# EasyEDA Pro project Explorer.eprj

# Schematic 驱动板

## Sheets
1 STM32C6T6: Create Date: 2024-03-30; Page Name: STM32C6T6; Project Name: 遥控小车+机械臂; Schematic Name: 原理图; Update Date: 2024-03-30; Company: 嘉立创EDA; Drawed: Ideal_Fox; Page Size: A4; Version: V1.0
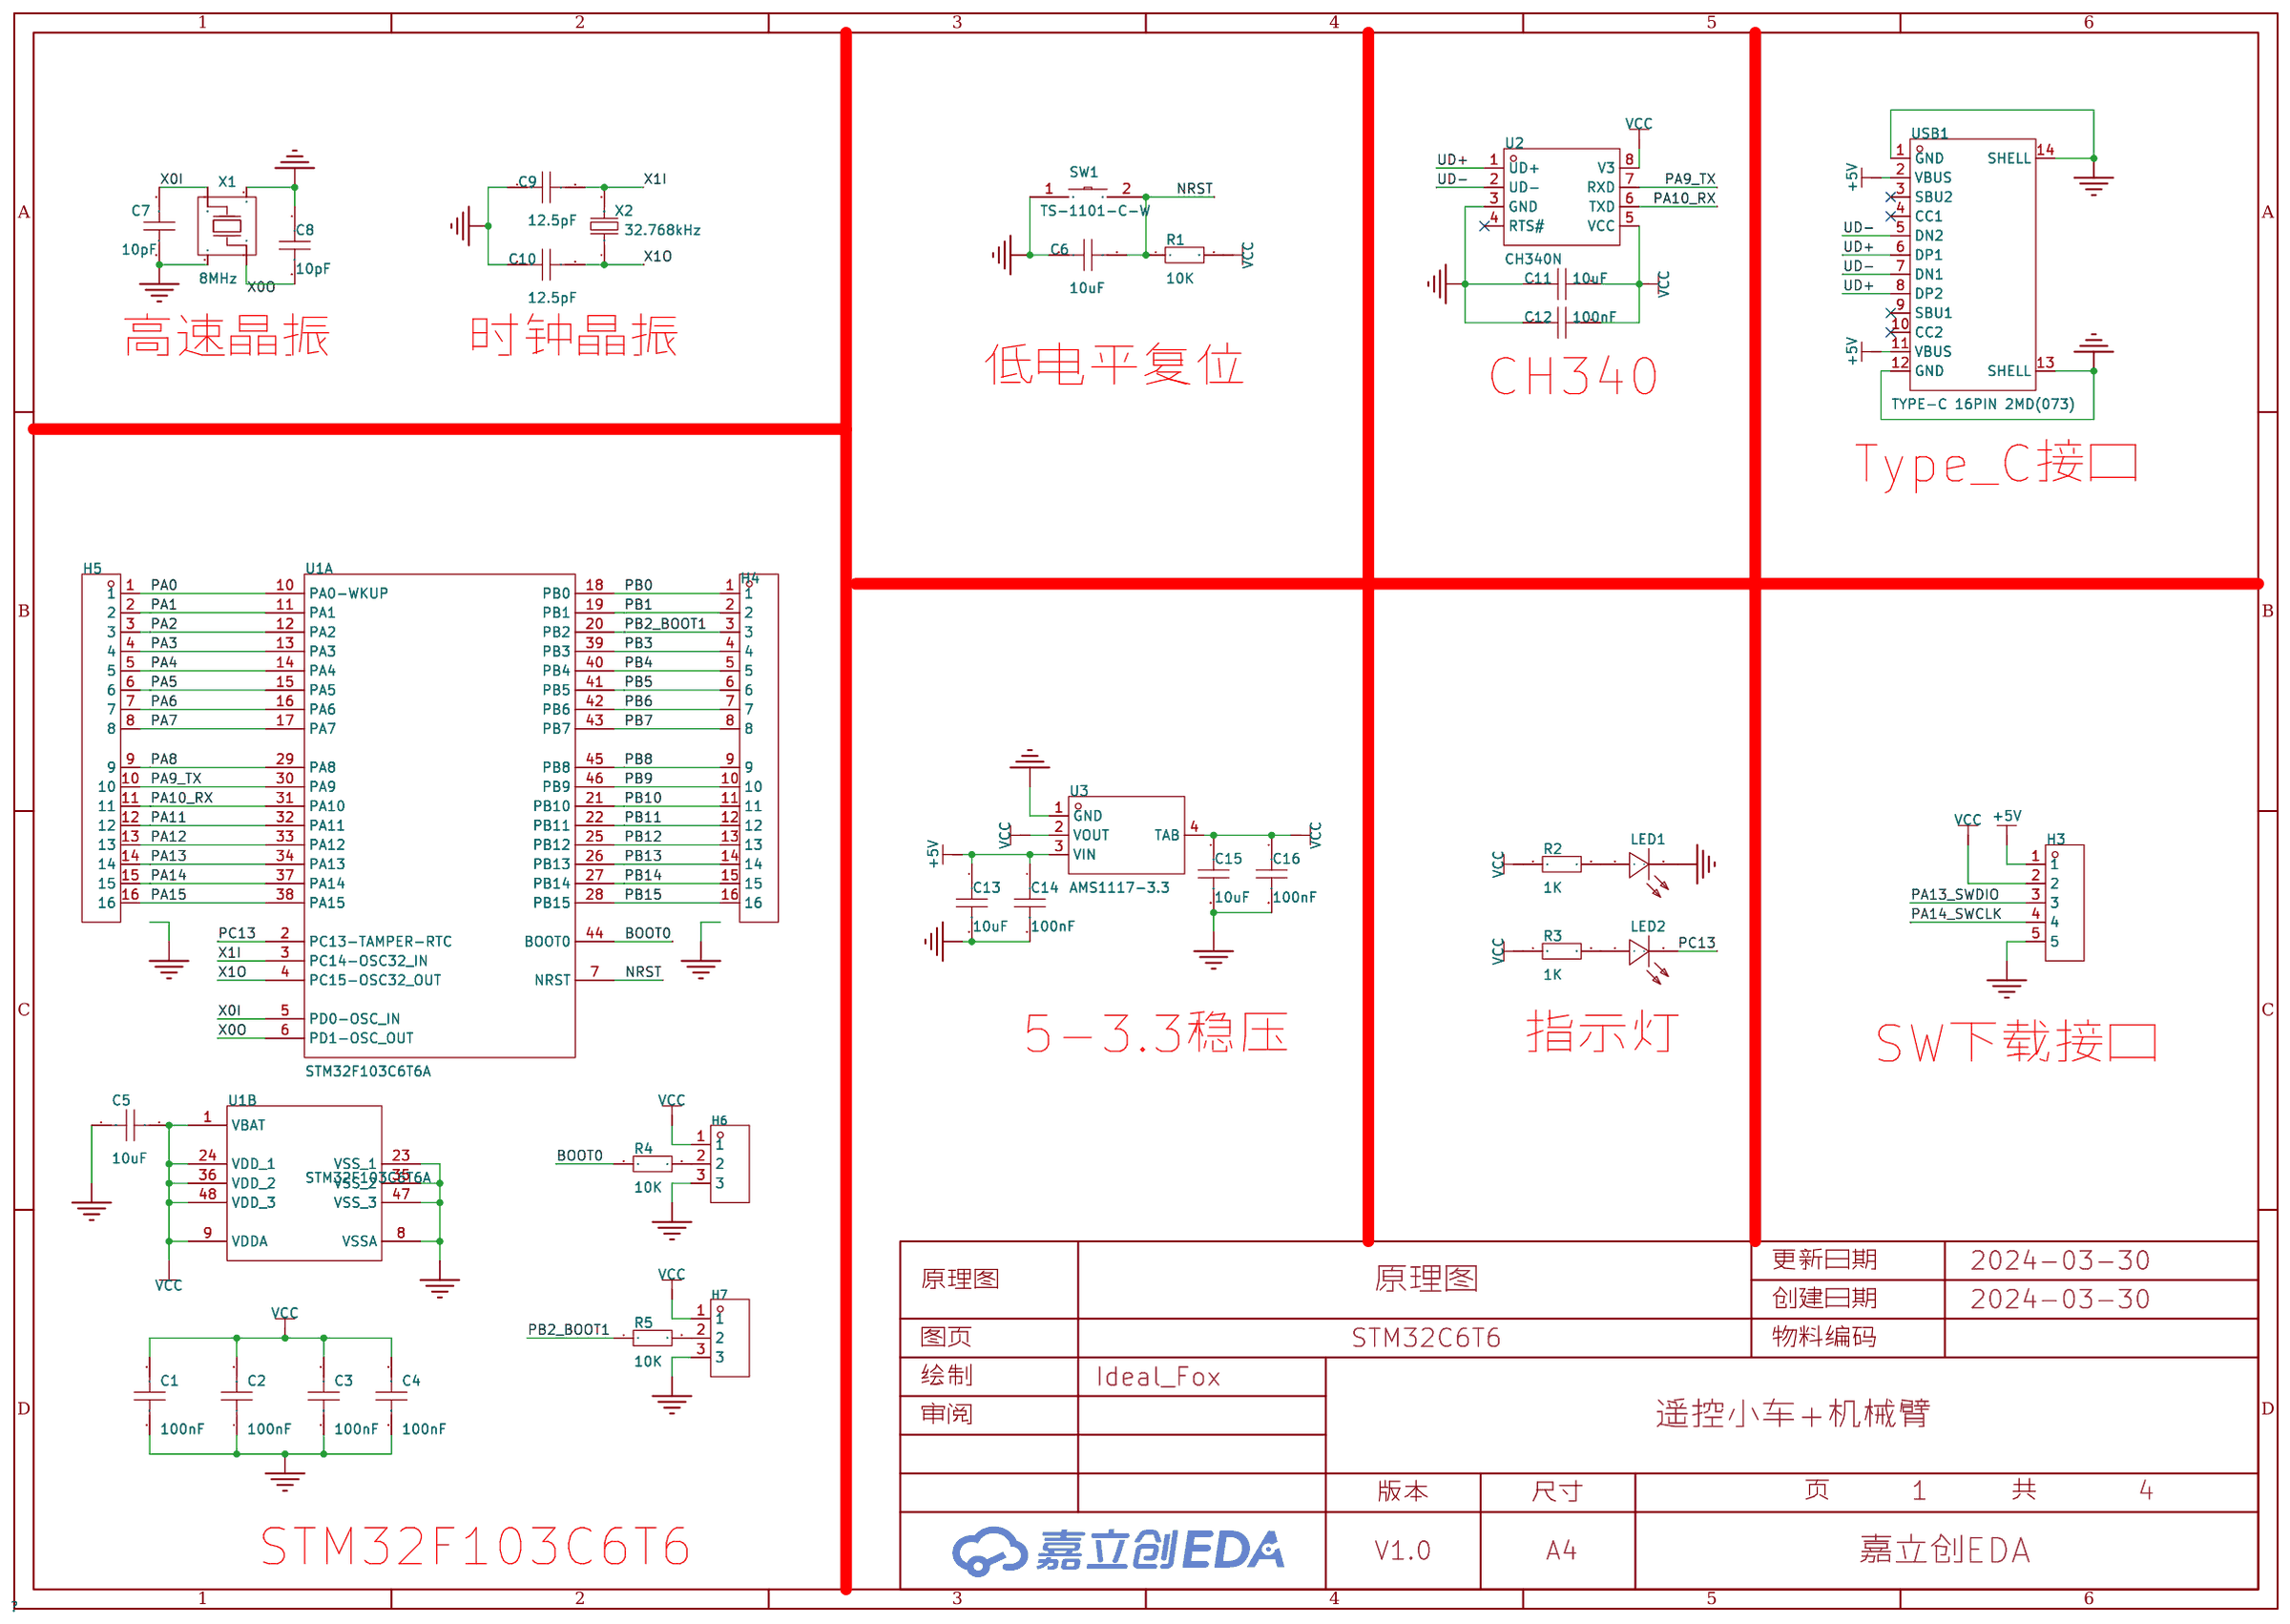
[diagram p0: STM32C6T6]
2 机械臂控制电路: Page Name: 机械臂控制电路; Schematic Name: 接收控制; Update Date: 2024-04-04
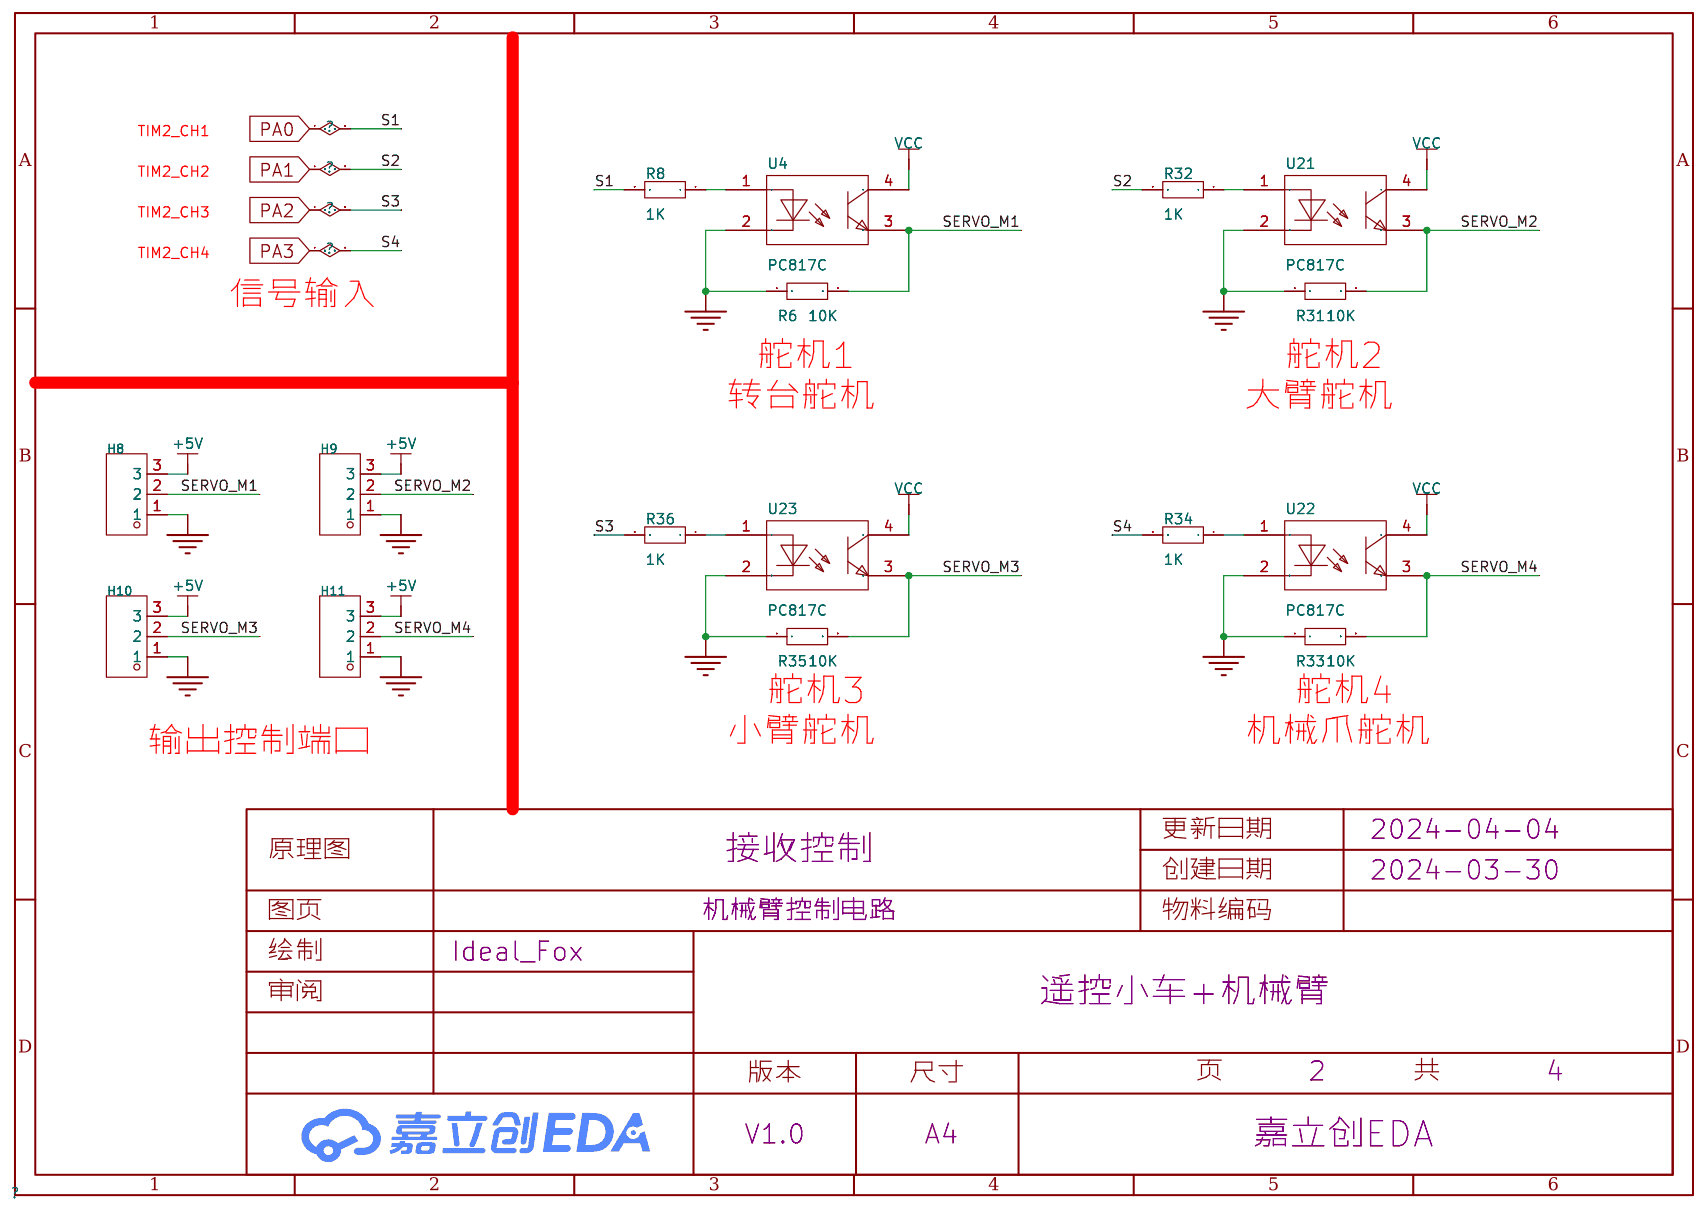
[diagram p1: 机械臂控制电路]
3 小车控制电路: Create Date: 2024-04-02; Page Name: 小车控制电路; Project Name: Explorer; Schematic Name: 驱动板; Update Date: 2024-10-26
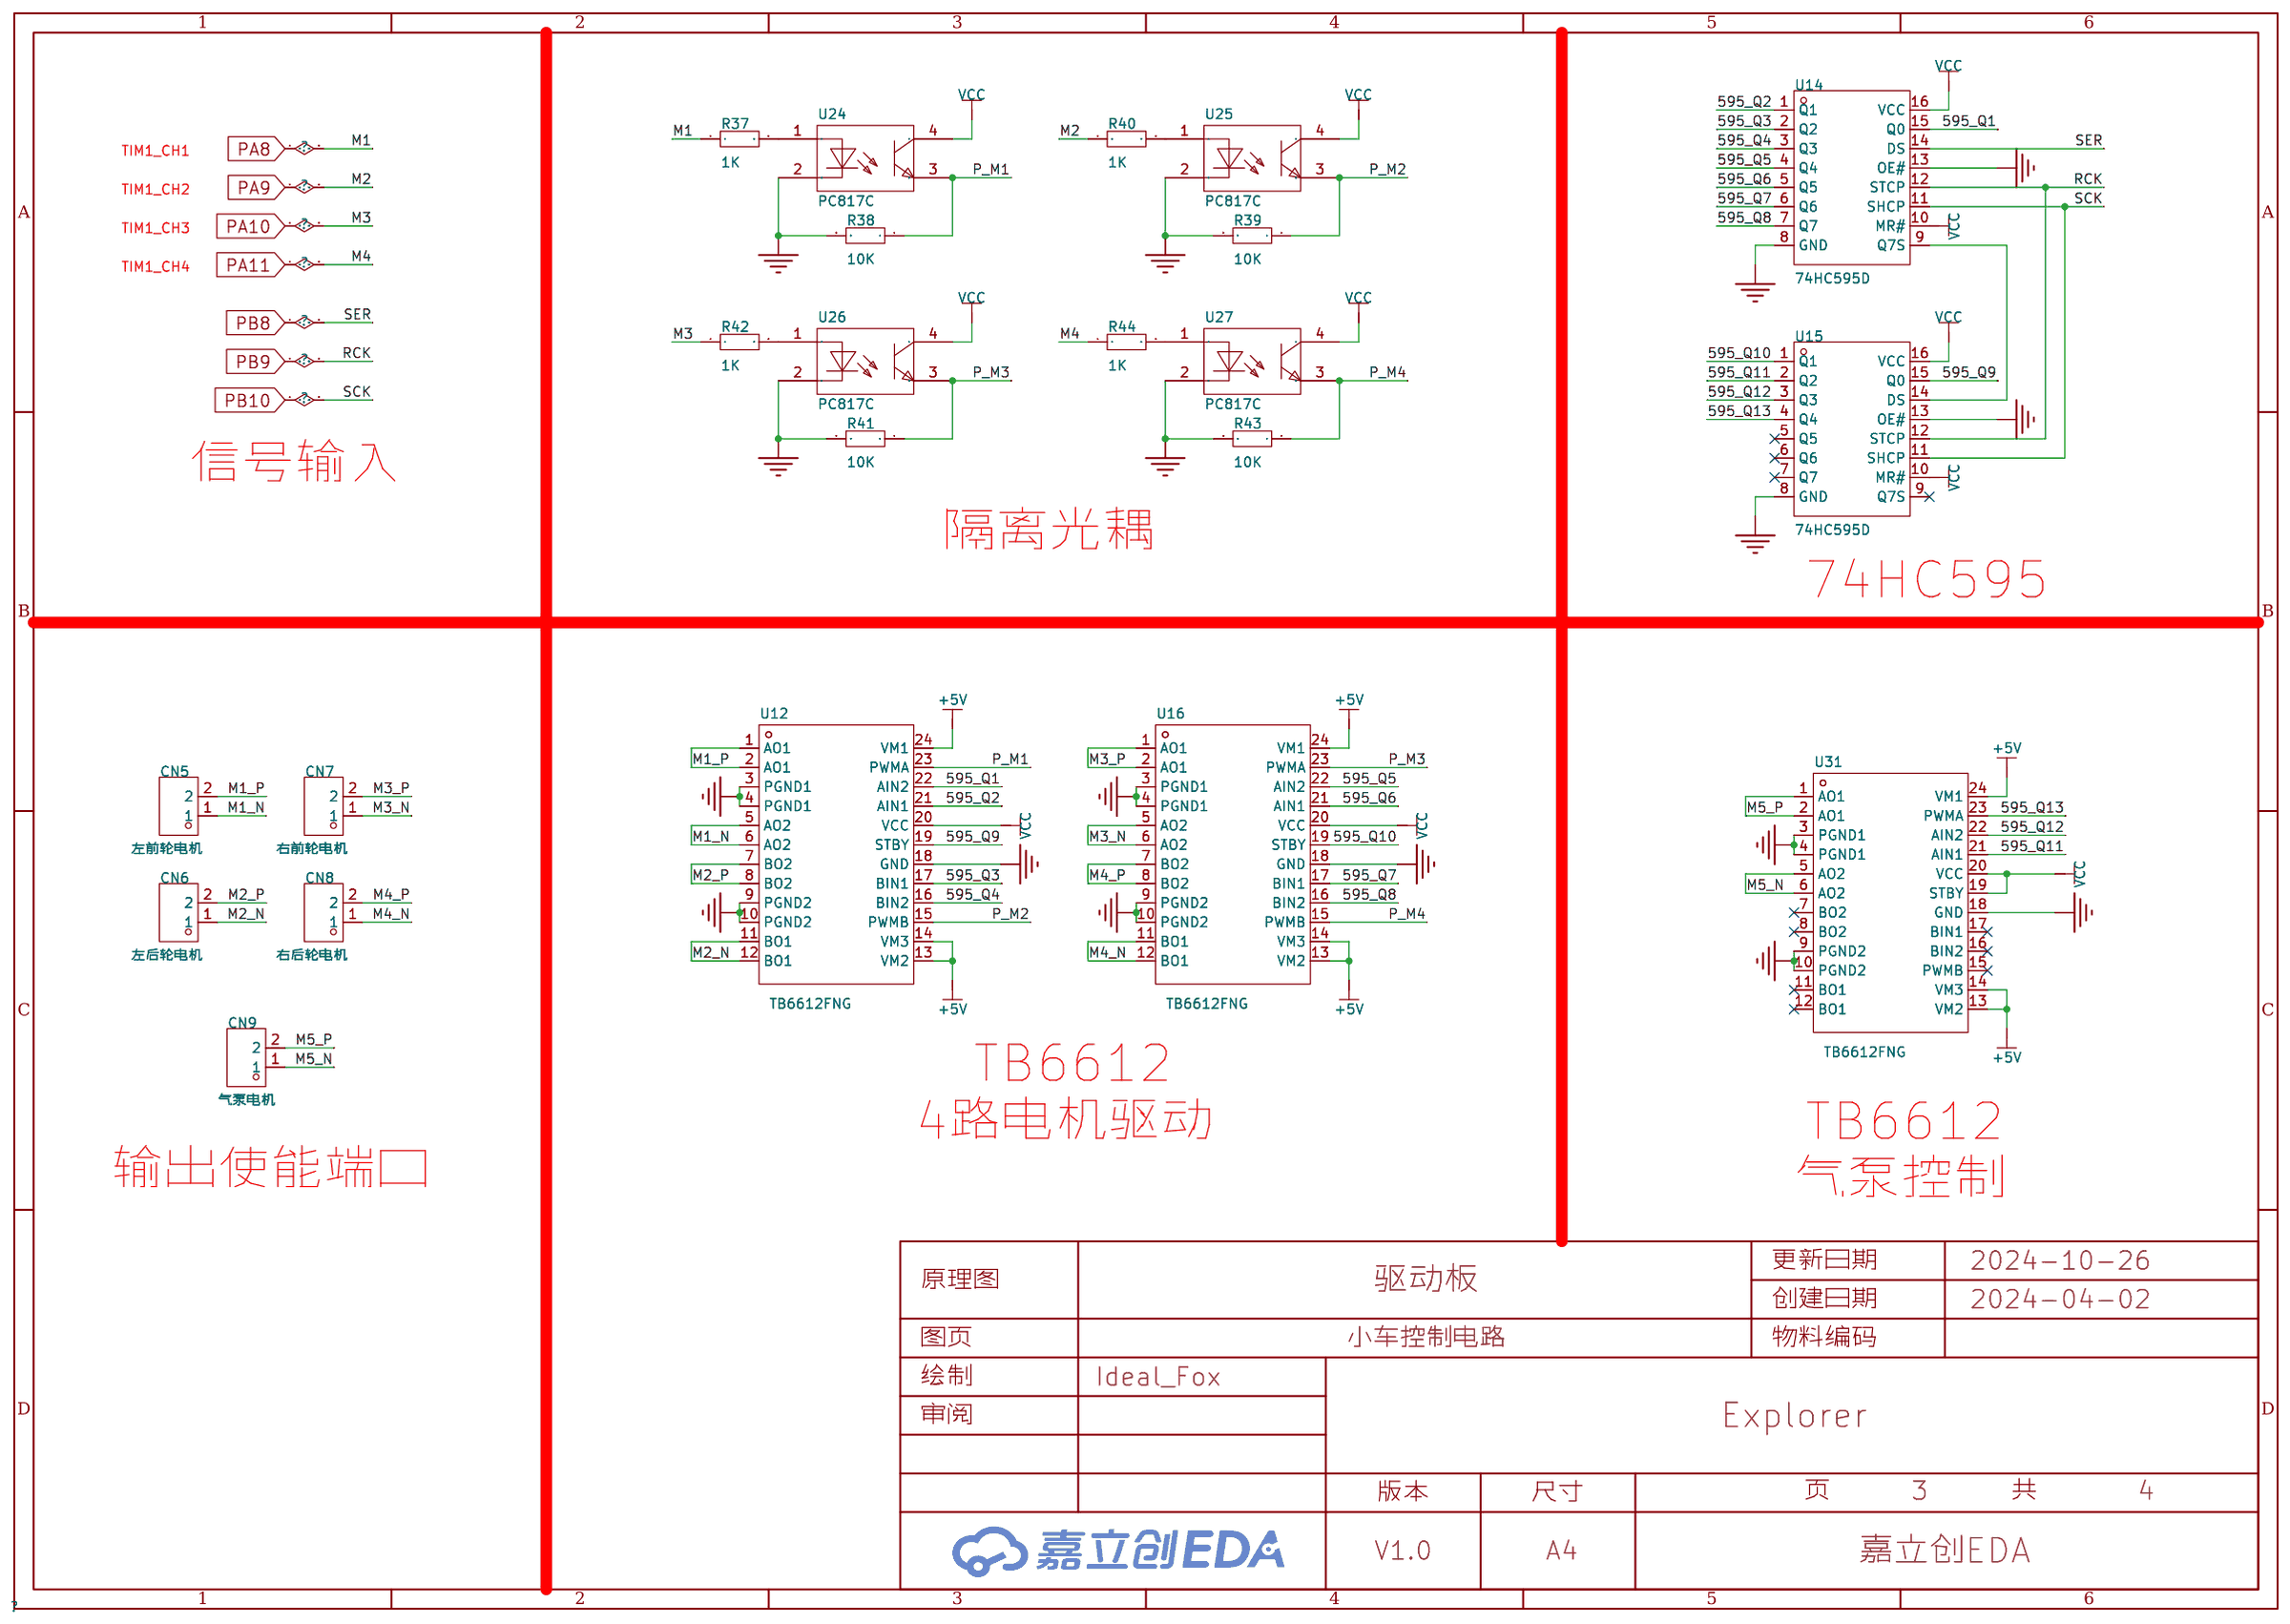
[diagram p2: 小车控制电路]
4 Other: Create Date: 2024-04-06; Page Name: Other; Project Name: Explorer; Schematic Name: 驱动板; Update Date: 2024-05-18; Page Size: A5
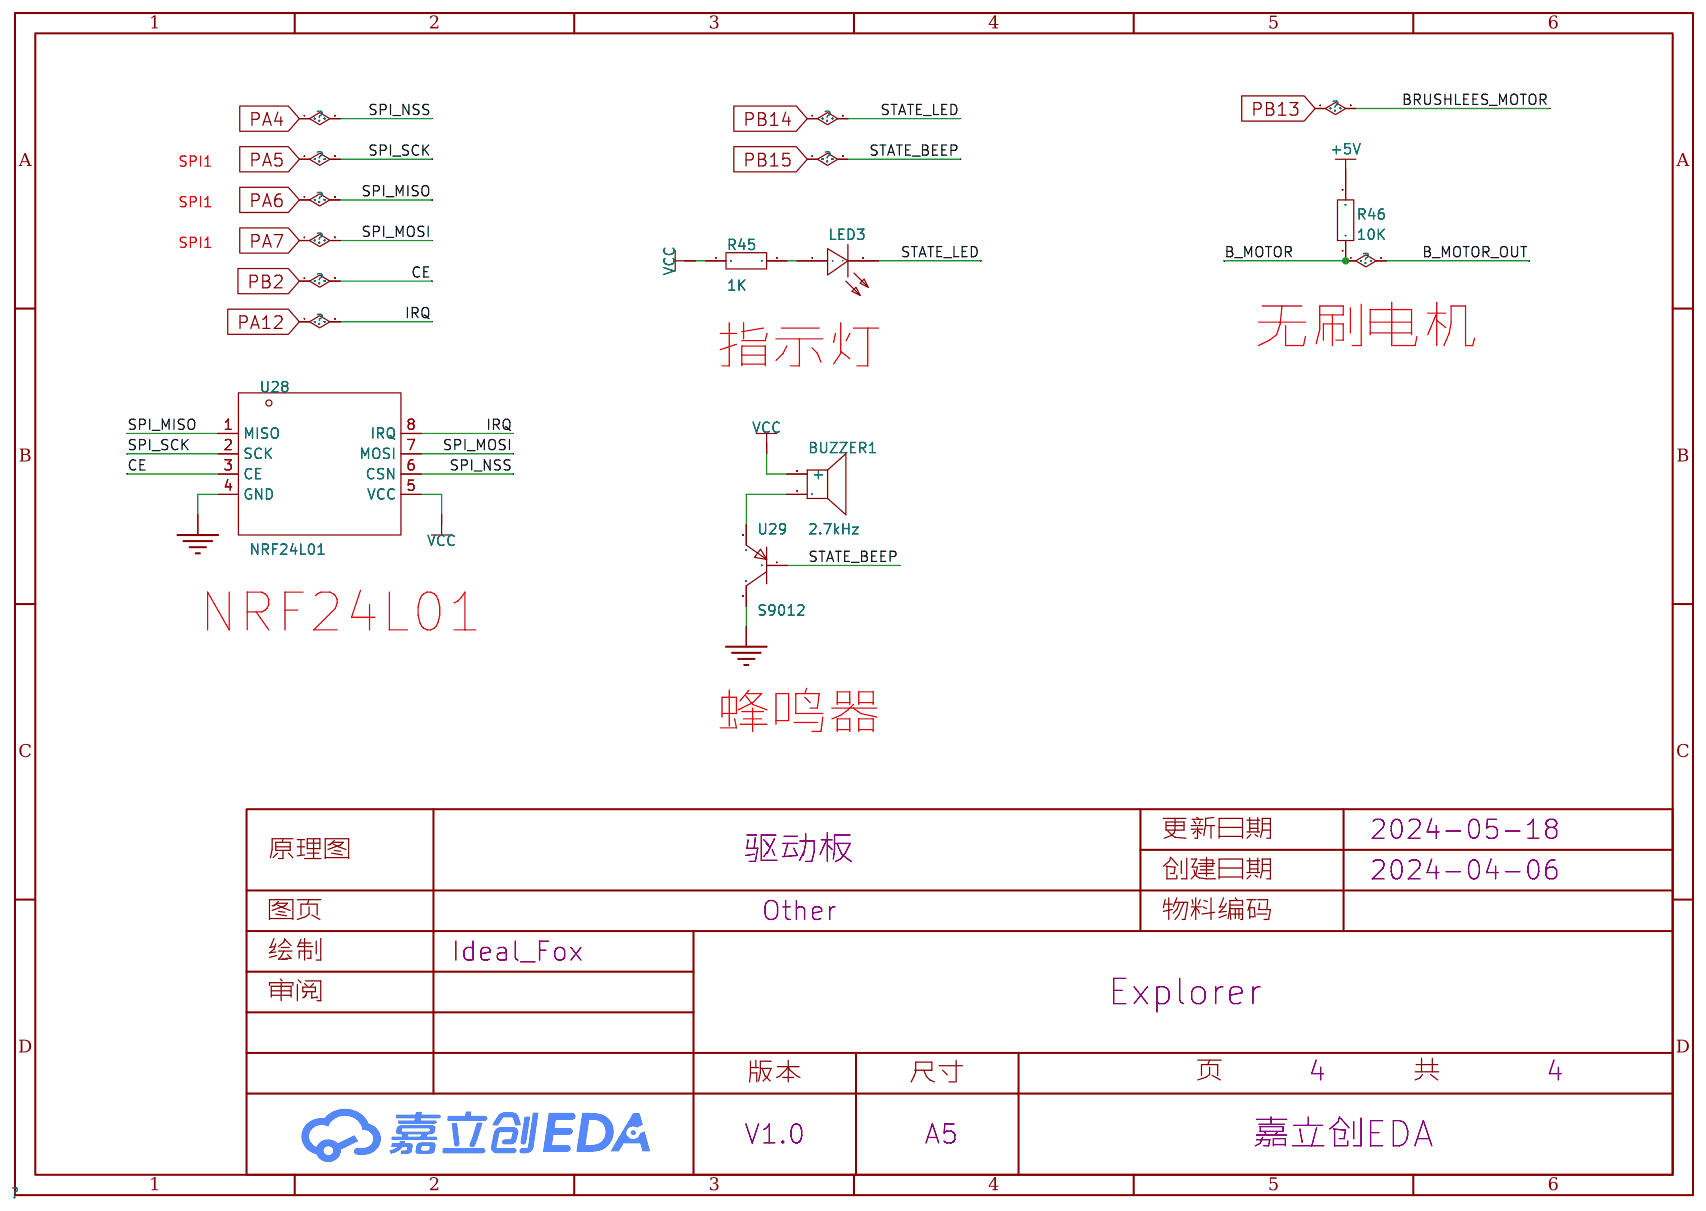
[diagram p3: Other]

## Parts
sheet Other
BUZZER1  2.7kHz  [BUZ-TH_BD12.0-P7.60-D0.6-FD]
LED3  NCD0805R1  [LED0805-R-RD]
R45  1K  [R0603]
R46  10K  [R0603]
U28  NRF24L01  [QFN-20_L4.0-W4.0-P0.50-BL-EP2.7]
U29  S9012  [SOT-23-3_L2.9-W1.4-P1.90-LS2.6-BR]
sheet STM32C6T6
C1  100nF  [C0603]
C2  100nF  [C0603]
C3  100nF  [C0603]
C4  100nF  [C0603]
C5  10uF  [C0603]
C6  10uF  [C0603]
C7  10pF  [C0603]
C8  10pF  [C0603]
C9  12.5pF  [C0603]
C10  12.5pF  [C0603]
C11  10uF  [C0603]
C12  100nF  [C0603]
C13  10uF  [C0603]
C14  100nF  [C0603]
C15  10uF  [C0603]
C16  100nF  [C0603]
H3  PZ254-1-05-W-8.5  [HDR-TH_5P-P2.54-H-M-W10.4-N]
H4  X6511WV-20H-C60D30  [HDR-TH_20P-P2.54-V-M]
H5  X6511WV-20H-C60D30  [HDR-TH_20P-P2.54-V-M]
H6  PZ254V-11-03P  [HDR-TH_3P-P2.54-V-M]
H7  PZ254V-11-03P  [HDR-TH_3P-P2.54-V-M]
LED1  NCD0805R1  [LED0805-R-RD]
LED2  NCD0805R1  [LED0805-R-RD]
R1  10K  [R0603]
R2  1K  [R0603]
R3  1K  [R0603]
R4  10K  [R0603]
R5  10K  [R0603]
SW1  TS-1101-C-W  [SW-SMD_L6.0-W3.3-LS8.0]
U1  STM32F103C6T6A  [LQFP-48_L7.0-W7.0-P0.50-LS9.0-BL]  (sections 1,2)
U2  CH340N  [SOP-8_L4.9-W3.9-P1.27-LS6.0-BL]
U3  AMS1117-3.3  [SOT-223-3_L6.5-W3.5-P3.05-LS7.0]
USB1  TYPE-C 16PIN 2MD(073)  [USB-C-SMD_TYPE-C-6PIN-2MD-073]
X1  8MHz  [OSC-SMD_4P-L3.2-W2.5-BL]
X2  32.768kHz  [FC-135R_L3.2-W1.5]
sheet 小车控制电路
CN5  左前轮电机  [CONN-TH_KF2510-2A]
CN6  左后轮电机  [CONN-TH_KF2510-2A]
CN7  右前轮电机  [CONN-TH_KF2510-2A]
CN8  右后轮电机  [CONN-TH_KF2510-2A]
CN9  气泵电机  [CONN-TH_KF2510-2A]
R37  1K  [R0603]
R38  10K  [R0603]
R39  10K  [R0603]
R40  1K  [R0603]
R41  10K  [R0603]
R42  1K  [R0603]
R43  10K  [R0603]
R44  1K  [R0603]
U12  TB6612FNG  [SSOP-24_L8.3-W5.6-P0.65-LS7.6-BL]
U14  74HC595D  [SOIC-16_L9.9-W3.9-P1.27-LS6.0-BL]
U15  74HC595D  [SOIC-16_L9.9-W3.9-P1.27-LS6.0-BL]
U16  TB6612FNG  [SSOP-24_L8.3-W5.6-P0.65-LS7.6-BL]
U24  PC817C  [OPTO-SMD-4_L4.6-W6.5-P2.54-LS10.3-TL]
U25  PC817C  [OPTO-SMD-4_L4.6-W6.5-P2.54-LS10.3-TL]
U26  PC817C  [OPTO-SMD-4_L4.6-W6.5-P2.54-LS10.3-TL]
U27  PC817C  [OPTO-SMD-4_L4.6-W6.5-P2.54-LS10.3-TL]
U31  TB6612FNG  [SSOP-24_L8.3-W5.6-P0.65-LS7.6-BL]
sheet 机械臂控制电路
H8  PZ254V-11-03P  [HDR-TH_3P-P2.54-V-M]
H9  PZ254V-11-03P  [HDR-TH_3P-P2.54-V-M]
H10  PZ254V-11-03P  [HDR-TH_3P-P2.54-V-M]
H11  PZ254V-11-03P  [HDR-TH_3P-P2.54-V-M]
R6  10K  [R0603]
R8  1K  [R0603]
R31  10K  [R0603]
R32  1K  [R0603]
R33  10K  [R0603]
R34  1K  [R0603]
R35  10K  [R0603]
R36  1K  [R0603]
U4  PC817C  [OPTO-SMD-4_L4.6-W6.5-P2.54-LS10.3-TL]
U21  PC817C  [OPTO-SMD-4_L4.6-W6.5-P2.54-LS10.3-TL]
U22  PC817C  [OPTO-SMD-4_L4.6-W6.5-P2.54-LS10.3-TL]
U23  PC817C  [OPTO-SMD-4_L4.6-W6.5-P2.54-LS10.3-TL]

## Library data of the parts
BUZZER1 = TMB12A05_C96093: 驱动方式:有源(内含驱动线路);构造类型:电磁式;频率:2.7kHz;声压(SPL):85dB;; LCSC Part Name: TMB12A05; Supplier Part: C96093; Manufacturer: 华能; Manufacturer Part: TMB12A05; Supplier Footprint: 插件,D=12mm; JLCPCB Part Class: 扩展库; Datasheet: https://atta.szlcsc.com/upload/public/pdf/source/20230426/A4FC10532558AA232D532AB83455FBA4.pdf; Supplier: LCSC; Oscillator Circuit: 有源(内含驱动线路); Technology Type: 电磁式; Operating Voltage: 4V~8V; Sound Pressure Level (SPL): 85dB; Diameter (φD): 12mm; Height: 9.8mm
LED1-LED3 = NCD0805R1: 灯头类型:-;发光颜色:红色;正向电压(VF):1.6V~2.6V;功率:65mW;正向电流:20mA;主波长:615nm~630nm;二极管配置:独立二极管;透镜颜色:无色透明透镜;色温:-;发光强度:67mcd~195mcd;发光角度:130°;载带方式:-;工作温度:-30℃~+85℃;; Supplier Part: C84256; Manufacturer: 国星光电; Supplier Footprint: 0805; JLCPCB Part Class: 基础库; Datasheet: https://atta.szlcsc.com/upload/public/pdf/source/20200820/C84256_F0A75A43B3EAD75808600A0514C76B99.pdf; Supplier: LCSC; Emitted Color: 红色; Forward Voltage (VF): 1.6V~2.6V; Power Dissipation: 65mW; Forward Current: 20mA; Dominant Wavelength: 615nm~630nm; Diode Configuration: 独立二极管; Lens Color: 无色透明透镜; Luminous Intensity: 67mcd~195mcd; Viewing Angle: 130°; Operating Temperature: -30℃~+85℃
R1-R6 R8 R31-R46 = Res_0603: Supplier Footprint: 0603
U28 = NRF24L01: 频率范围:2.4GHz;接口:SPI;应用领域:通用 ISM&gt;1GHz;数据速率:2Mbps;灵敏度:-85dBm;; Supplier Part: C1558392; Manufacturer: NORDIC; Supplier Footprint: QFN-20-EP(4x4); JLCPCB Part Class: 扩展库; Supplier: LCSC; Frequency Range: 2.4GHz; Interface: SPI; Operating Voltage: 1.9V~3.6V; Applications: 通用 ISM&gt;1GHz; Output Power: 0dBm; Data Rate: 2Mbps; Current Of Transmitting: 7mA; Sensitivity: -85dBm; Receive Current: 11.1mA; Operating Temperature: -40℃~+85℃
U29 = S9012_C5204710: 晶体管类型：PNP 集射极击穿电压(Vceo)：25V 集电极电流(Ic)：500mA 功率(Pd)：300mW; Supplier Part: C5204710; Manufacturer: TWGMC(台湾迪嘉); Supplier Footprint: SOT-23; JLCPCB Part Class: 扩展库; Datasheet: https://atta.szlcsc.com/upload/public/pdf/source/20221019/7A4A581668A3BED1EE567F4F9DF28250.pdf; Supplier: LCSC
C1-C16 = CAP_0603: Supplier Footprint: 0603
H3 = PZ254-1-05-W-8.5: 插针结构:1x5P;间距:2.54mm;行距:-;圆针/方针:方针;安装类型:弯插;排数:单排;总PIN位数:5P;额定电流:3A;额定电压:-;配合针长度:6mm;塑高:2.5mm;端接针长度:-;触头材质:-;工作温度范围:-40℃~+105℃;焊接温度(最大值):260℃@10S;颜色:黑色;; LCSC Part Name: 1x5P 间距:2.54mm 方针 弯插; Supplier Part: C2894947; Manufacturer: HCTL(华灿天禄); Supplier Footprint: 弯插,P=2.54mm; JLCPCB Part Class: 扩展库; Datasheet: https://atta.szlcsc.com/upload/public/pdf/source/20230609/872AF364EDF8DB2CAF0930EAB94ECB6E.pdf; Supplier: LCSC; Pin Structure: 1x5P; Pitch: 2.54mm; Circluar Pins/Square Pins: 方针; Mounting Type: 弯插; Number of Rows: 单排; Number of Pins: 5P; Current Rating (Max): 3A; Length of Mating Pin: 6mm; Insulation Height: 2.5mm; Operating Temperature Range: -40℃~+105℃; Soldering Temperature(Max): 260℃@10S; Color: 黑色
H4 H5 = X6511WV-20H-C60D30: 插针结构:1x20P;间距:2.54mm;行距:2.54mm;圆针/方针:方针;安装类型:直插;排数:单排;总PIN位数:20P;额定电流:3A;额定电压:250V;配合针长度:6mm;塑高:2.5mm;端接针长度:3mm;触头材质:黄铜;触头镀层:金;工作温度范围:-40℃~+105℃;焊接温度(最大值):260℃;颜色:黑色;; LCSC Part Name: 1x20P 间距:2.54mm 方针 直插; Supplier Part: C725952; Manufacturer: XKB Connection(中国星坤); Supplier Footprint: 插件,P=2.54mm; JLCPCB Part Class: 扩展库; Datasheet: https://atta.szlcsc.com/upload/public/pdf/source/20221108/2FDDF9C694C8EDC81165E23F2EAAE597.pdf; Supplier: LCSC; Pin Structure: 1x20P; Pitch: 2.54mm; Row Spacing: 2.54mm; Circluar Pins/Square Pins: 方针; Mounting Type: 直插; Number of Rows: 单排; Number of Pins: 20P; Current Rating (Max): 3A; Voltage Rating (Max): 250V; Length of Mating Pin: 6mm; Insulation Height: 2.5mm; Length of End Connection Pin: 3mm; Contact Material: 黄铜; Contact Plating: 金; Operating Temperature Range: -40℃~+105℃; Soldering Temperature(Max): 260℃; Color: 黑色
H6-H11 = PZ254V-11-03P: 插针结构:1x3P;间距:2.54mm;行距:-;圆针/方针:方针;安装类型:直插;排数:单排;总PIN位数:3P;额定电流:3A;额定电压:250V;配合针长度:6mm;塑高:2.5mm;端接针长度:3mm;工作温度范围:-40℃~+105℃;颜色:黑色;; LCSC Part Name: 间距:2.54mm 1x3P 直插 方针; Supplier Part: C2937625; Manufacturer: XFCN(兴飞); Supplier Footprint: 插件,P=2.54mm; JLCPCB Part Class: 扩展库; Datasheet: https://atta.szlcsc.com/upload/public/pdf/source/20200309/C492402_8335C3D49C4E4C618838D59BB1D024C1.pdf; Supplier: LCSC; Pin Structure: 1x3P; Pitch: 2.54mm; Circluar Pins/Square Pins: 方针; Mounting Type: 直插; Number of Rows: 单排; Number of Pins: 3P; Current Rating (Max): 3A; Voltage Rating (Max): 250V; Length of Mating Pin: 6mm; Insulation Height: 2.5mm; Length of End Connection Pin: 3mm; Operating Temperature Range: -40℃~+105℃; Color: 黑色
SW1 = TS-1101-C-W: 电路结构:单刀单掷;按钮形状:矩形按钮;作用力:260gf;安装方式:立贴;开关长度:6mm;开关宽度:3.6mm;开关高度:2.5mm;带支架:不带;触点电流:50mA;额定电压(AC):-;额定电压(DC):12V;额定功率:-;绝缘电阻:-;带灯:无;机械寿命:5万次;; LCSC Part Name: 6*3.6*2.5mm 立贴 轻触开关; Supplier Part: C318938; Manufacturer: XKB Connectivity(中国星坤); Supplier Footprint: SMD; JLCPCB Part Class: 扩展库; Datasheet: https://atta.szlcsc.com/upload/public/pdf/source/20200227/C318938_C2E53B1EEDE37D980A33616AC086DE53.pdf; Supplier: LCSC; Circuit: 单刀单掷; Actuator Style: 矩形按钮; Operating Force: 260gf; Mounting Style: 立贴; Switch Length: 6mm; Switch Width: 3.6mm; Switch Height: 2.5mm; Strike Gundam: 不带; Contact Current: 50mA; Voltage Rating (DC): 12V; Actuator/Cap Color: 白色带淡绿; With Lamp: 无; Mechanical Life: 5万次; Operating Temperature: -30℃~+85℃
U1 = STM32F103C6T6A: CPU内核:CM3;程序存储容量:32KB;RAM总容量:10KB;GPIO端口数量:37;工作电压范围:2V~3.6V;CPU最大主频:72MHz;程序存储器类型:FLASH;; Supplier Part: C8303; Manufacturer: ST(意法半导体); Supplier Footprint: LQFP-48(7x7); JLCPCB Part Class: 扩展库; Datasheet: https://atta.szlcsc.com/upload/public/pdf/source/20140724/1457707171306.pdf; Supplier: LCSC; CPU Core: CM3; Program Storage Size: 32KB; RAM Size: 10KB; GPIO Ports Number: 37; Operating Voltage Range: 2V~3.6V; CPU Maximum Speed: 72MHz; Program Memory Type: FLASH; Operating Temperature Range: -40℃~+85℃; ADC (Bit): 12bit; Universal Serial Bus: 有; Peripheral/Function: DMA；片载温度传感器；PWM; Watchdog: 有; Infrared Data Association: 有; Low-Voltage Detect: 有; Direct Memory Access: 有; Internal Oscillator: 有
U2 = CH340N: LCSC Part Name: USB转串口芯片 CH340; Supplier Part: C2977777; Manufacturer: WCH(南京沁恒); Supplier Footprint: SOP-8; JLCPCB Part Class: 扩展库; Datasheet: https://atta.szlcsc.com/upload/public/pdf/source/20230530/6E401E9554E9F5311886CC8B3F89B62E.pdf; Supplier: LCSC
U3 = AMS1117-3.3_C5250992: 输出类型：固定 输出极性：正 最大输入电压：18V 输出电压：3.3V 输出电流：1A 电源纹波抑制比(PSRR)：60dB@(120Hz)。当前应用较多领域：三端稳压器，机顶盒; Supplier Part: C5250992; Manufacturer: TWGMC(台湾迪嘉); Supplier Footprint: SOT-223-3L; JLCPCB Part Class: 扩展库; Datasheet: https://atta.szlcsc.com/upload/public/pdf/source/20221109/A58A92B07670E85D28928AE371260E8D.pdf; Supplier: LCSC
USB1 = TYPE-C 16PIN 2MD(073): 连接器类型:Type-C;标准:-;公母:母;端口数量:1;触点数量:16P;安装方式:卧贴;额定电流 - 电源:5A;工作温度范围:-25℃~+85℃;; LCSC Part Name: Type-C 母 卧贴; Supplier Part: C2765186; Manufacturer: SHOU HAN(首韩); Supplier Footprint: SMD; JLCPCB Part Class: 扩展库; Datasheet: https://atta.szlcsc.com/upload/public/pdf/source/20211123/39B17C16241EAC15C5E277BDA434118E.pdf; Supplier: LCSC; Connector Type: Type-C; Gender: 母; Number of Ports: 1; Number of Contacts: 16P; Mounting Style: 卧贴; Current Rating - Power (Max): 5A; Operating Temperature Range: -25℃~+85℃
X1 = TAXM8M4RDBCCT2T: 晶振类型:贴片晶振;频率:8MHz;常温频差:±10ppm;外接负载电容:10pF;频率稳定度(全温):±15ppm;; LCSC Part Name: 8MHz ±10ppm 10pF; Supplier Part: C400090; Manufacturer: YJX(雅晶鑫); Supplier Footprint: SMD3225-4P; JLCPCB Part Class: 扩展库; Datasheet: https://atta.szlcsc.com/upload/public/pdf/source/20190626/C400090_CF95B89E745AFE4EF2E392EF8AC009D6.pdf; Supplier: LCSC; Crystal Type: 贴片晶振; Normal temperature Frequency Tolerance: ±10ppm; External load capacitor: 10pF; Frequency Stability(Full temperature range): ±15ppm; Equivalent Series Resistance (ESR): 250Ω; Operating Temperature: -40℃~+85℃
X2 = Q13FC13500004_C32346: 晶振类型:贴片晶振;频率:32.768kHz;常温频差:±20ppm;外接负载电容:12.5pF;; LCSC Part Name: 32.768kHz ±20ppm 12.5pF; Supplier Part: C32346; Manufacturer: EPSON(爱普生); Manufacturer Part: Q13FC13500004; Supplier Footprint: SMD3215-2P; JLCPCB Part Class: 基础库; Datasheet: https://atta.szlcsc.com/upload/public/pdf/source/20190108/C32346_746D6B07EAF90824457A96480007685F.pdf; Supplier: LCSC; Crystal Type: 贴片晶振; Normal temperature Frequency Tolerance: ±20ppm; External load capacitor: 12.5pF; Equivalent Series Resistance (ESR): 70kΩ; Operating Temperature: -40℃~+85℃
CN5-CN9 = 外接电机-KF2510直针 两个针间距2.54mm: Supplier Part: C9900020270; Supplier Footprint: CONN-TH_2P; JLCPCB Part Class: 扩展库; Supplier: LCSC
U12 U16 U31 = TB6612FNG,C,8,EL: 驱动电机类型:有刷直流电机;电源电压:2.7V~5.5V;输出电流:1A;接口:并行;; LCSC Part Name: 1A 有刷直流电机驱动芯片 5.5V; Supplier Part: C141517; Manufacturer: TOSHIBA(东芝); Supplier Footprint: SSOP-24; JLCPCB Part Class: 扩展库; Datasheet: https://atta.szlcsc.com/upload/public/pdf/source/20171128/C141517_15118625624231147036.pdf; Supplier: LCSC; Drive motor type: 有刷直流电机; Supply Voltage: 2.7V~5.5V; Output Current: 1A; Interface: 并行; Operating Temperature: -20℃~+85℃@(Ta)
U14 U15 = 74HC595D,118: 功能:串行至串行或并行;电源电压:2V~6V;元件数:1;每个元件位数:8;; LCSC Part Name: 三态输出 串行至串行或并行移位寄存器; Supplier Part: C5947; Manufacturer: Nexperia(安世); Supplier Footprint: SOIC-16; JLCPCB Part Class: 基础库; Datasheet: https://atta.szlcsc.com/upload/public/pdf/source/20140108/1457706668762.pdf; Supplier: LCSC; Function: 串行至串行或并行; Supply Voltage: 2V~6V; Number of Elements: 1; Number of Bits per Element: 8; Output Type: 三态; Series: 74HC; Operating Temperature: -40℃~+125℃
U4 U21-U27 = PC817C_C3025164: CTR:200%~400%; LCSC Part Name: C档; Supplier Part: C3025164; Manufacturer: GOODWORK(固得沃克); Supplier Footprint: SMD-4P; JLCPCB Part Class: 扩展库; Datasheet: https://atta.szlcsc.com/upload/public/pdf/source/20220530/3FD5D572B823BA05C967330A07ECF74F.pdf; Supplier: LCSC

## Nets
+5V: C13.1 C14.1 H3.1 H8.3 H9.3 H10.3 H11.3 R46.2 U3.3(VIN) U12.13(VM2) U12.14(VM3) U12.24(VM1) U16.13(VM2) U16.14(VM3) U16.24(VM1) U31.13(VM2) U31.14(VM3) U31.24(VM1) USB1.2(VBUS) USB1.11(VBUS)
GND: C1.1 C2.1 C3.1 C4.1 C5.2 C6.2 C7.2 C8.1 C9.1 C10.1 C11.1 C12.1 C13.2 C14.2 C15.2 C16.2 H3.5 H6.3 H7.3 H8.1 H9.1 H10.1 H11.1 LED1.2(-) R6.1 R31.1 R33.1 R35.1 R38.2 R39.2 R41.2 R43.2 SW1.1 U1.8(VSSA) U1.23(VSS_1) U1.35(VSS_2) U1.47(VSS_3) U2.3(GND) U3.1(GND) U4.2 U12.3(PGND1) U12.4(PGND1) U12.9(PGND2) U12.10(PGND2) U12.18(GND) U14.8(GND) U14.13(OE#) U15.8(GND) U15.13(OE#) U16.3(PGND1) U16.4(PGND1) U16.9(PGND2) U16.10(PGND2) U16.18(GND) U21.2 U22.2 U23.2 U24.2 U25.2 U26.2 U27.2 U28.4(GND) U29.3(C) U31.3(PGND1) U31.4(PGND1) U31.9(PGND2) U31.10(PGND2) U31.18(GND) USB1.1(GND) USB1.12(GND) USB1.13(SHELL) USB1.14(SHELL) X1.2 X1.4
VCC: BUZZER1.1(+) C1.2 C2.2 C3.2 C4.2 C5.1 C11.2 C12.2 C15.1 C16.1 H3.2 H6.1 H7.1 R1.2 R2.1 R3.1 R45.1 U1.1(VBAT) U1.9(VDDA) U1.24(VDD_1) U1.36(VDD_2) U1.48(VDD_3) U2.5(VCC) U2.8(V3) U3.2(VOUT) U3.4(TAB) U4.4 U12.20(VCC) U14.10(MR#) U14.16(VCC) U15.10(MR#) U15.16(VCC) U16.20(VCC) U21.4 U22.4 U23.4 U24.4 U25.4 U26.4 U27.4 U28.5(VCC) U31.19(STBY) U31.20(VCC)
595_Q1: U12.22(AIN2) U14.15(Q0)
595_Q2: U12.21(AIN1) U14.1(Q1)
595_Q3: U12.17(BIN1) U14.2(Q2)
595_Q4: U12.16(BIN2) U14.3(Q3)
595_Q5: U14.4(Q4) U16.22(AIN2)
595_Q6: U14.5(Q5) U16.21(AIN1)
595_Q7: U14.6(Q6) U16.17(BIN1)
595_Q8: U14.7(Q7) U16.16(BIN2)
595_Q9: U12.19(STBY) U15.15(Q0)
595_Q10: U15.1(Q1) U16.19(STBY)
595_Q11: U15.2(Q2) U31.21(AIN1)
595_Q12: U15.3(Q3) U31.22(AIN2)
595_Q13: U15.4(Q4) U31.23(PWMA)
B_MOTOR: R46.1
BOOT0: R4.1 U1.44(BOOT0)
BRUSHLEES_MOTOR: H4.14 U1.26(PB13)
CE: U28.3(CE)
IRQ: H5.13 U1.33(PA12) U28.8(IRQ)
M1: H5.9 R37.1 U1.29(PA8)
M1_N: CN5.1 U12.5(AO2) U12.6(AO2)
M1_P: CN5.2 U12.1(AO1) U12.2(AO1)
M2: R40.1
M2_N: CN6.1 U12.11(BO1) U12.12(BO1)
M2_P: CN6.2 U12.7(BO2) U12.8(BO2)
M3: R42.1
M3_N: CN7.1 U16.5(AO2) U16.6(AO2)
M3_P: CN7.2 U16.1(AO1) U16.2(AO1)
M4: H5.12 R44.1 U1.32(PA11)
M4_N: CN8.1 U16.11(BO1) U16.12(BO1)
M4_P: CN8.2 U16.7(BO2) U16.8(BO2)
M5_N: CN9.1 U31.5(AO2) U31.6(AO2)
M5_P: CN9.2 U31.1(AO1) U31.2(AO1)
NRST: C6.1 R1.1 SW1.2 U1.7(NRST)
P_M1: R38.1 U12.23(PWMA) U24.3
P_M2: R39.1 U12.15(PWMB) U25.3
P_M3: R41.1 U16.23(PWMA) U26.3
P_M4: R43.1 U16.15(PWMB) U27.3
PA0: H5.1 R8.2 U1.10(PA0-WKUP)
PA1: H5.2 R32.2 U1.11(PA1)
PA2: H5.3 R36.2 U1.12(PA2)
PA3: H5.4 R34.2 U1.13(PA3)
PA4: H5.5 U1.14(PA4) U28.6(CSN)
PA5: H5.6 U1.15(PA5) U28.2(SCK)
PA6: H5.7 U1.16(PA6) U28.1(MISO)
PA7: H5.8 U1.17(PA7) U28.7(MOSI)
PA9_TX: H5.10 U1.30(PA9) U2.7(RXD)
PA10_RX: H5.11 U1.31(PA10) U2.6(TXD)
PA13: H5.14 U1.34(PA13)
PA13_SWDIO: H3.3
PA14: H5.15 U1.37(PA14)
PA14_SWCLK: H3.4
PA15: H5.16 U1.38(PA15)
PB0: H4.1 U1.18(PB0)
PB1: H4.2 U1.19(PB1)
PB2_BOOT1: H4.3 R5.1 U1.20(PB2)
PB3: H4.4 U1.39(PB3)
PB4: H4.5 U1.40(PB4)
PB5: H4.6 U1.41(PB5)
PB6: H4.7 U1.42(PB6)
PB7: H4.8 U1.43(PB7)
PB8: H4.9 U1.45(PB8) U14.14(DS)
PB9: H4.10 U1.46(PB9) U14.12(STCP) U15.12(STCP)
PB10: H4.11 U1.21(PB10) U14.11(SHCP) U15.11(SHCP)
PB11: H4.12 U1.22(PB11)
PB12: H4.13 U1.25(PB12)
PB14: H4.15 LED3.2(-) U1.27(PB14)
PB15: H4.16 U1.28(PB15) U29.1(B)
PC13: LED2.2(-) U1.2(PC13-TAMPER-RTC)
SERVO_M1: H8.2 R6.2 U4.3
SERVO_M2: H9.2 R31.2 U21.3
SERVO_M3: H10.2 R35.2 U23.3
SERVO_M4: H11.2 R33.2 U22.3
UD+: U2.1(UD+) USB1.6(DP1) USB1.8(DP2)
UD-: U2.2(UD-) USB1.5(DN2) USB1.7(DN1)
X0I: C7.1 U1.5(PD0-OSC_IN) X1.3
X0O: C8.2 U1.6(PD1-OSC_OUT) X1.1
X1I: C9.2 U1.3(PC14-OSC32_IN) X2.2
X1O: C10.2 U1.4(PC15-OSC32_OUT) X2.1
Net-(BUZZER1-2): BUZZER1.2 U29.2(E)
Net-(H6-2): H6.2 R4.2
Net-(H7-2): H7.2 R5.2
Net-(LED1-1): LED1.1(+) R2.2
Net-(LED2-1): LED2.1(+) R3.2
Net-(LED3-1): LED3.1(+) R45.2
Net-(R8-1): R8.1 U4.1
Net-(R32-1): R32.1 U21.1
Net-(R34-1): R34.1 U22.1
Net-(R36-1): R36.1 U23.1
Net-(R37-2): R37.2 U24.1
Net-(R40-2): R40.2 U25.1
Net-(R42-2): R42.2 U26.1
Net-(R44-2): R44.2 U27.1
Net-(U14-9): U14.9(Q7S) U15.14(DS)

Not connected (* = marked no-connect by the designer): U2 4(RTS#)*; U15 5(Q5)* 6(Q6)* 7(Q7)* 9(Q7S)*; U31 7(BO2)* 8(BO2)* 11(BO1)* 12(BO1)* 15(PWMB)* 16(BIN2)* 17(BIN1)*; USB1 3(SBU2)* 4(CC1)* 9(SBU1)* 10(CC2)*

## Notes on the sheets
sheet 1
- 高速晶振
- 时钟晶振
- 低电平复位
- CH340
- Type_C接口
- 5-3.3稳压
- 指示灯
- SW下载接口
- STM32F103C6T6
sheet 2
- TIM2_CH1
- TIM2_CH2
- TIM2_CH3
- TIM2_CH4
- 信号输入
- 舵机1
- 舵机2
- 转台舵机
- 大臂舵机
- 舵机3
- 舵机4
- 输出控制端口
- 小臂舵机
- 机械爪舵机
sheet 3
- TIM1_CH1
- TIM1_CH2
- TIM1_CH3
- TIM1_CH4
- 信号输入
- 隔离光耦
- 74HC595
- TB6612
- 4路电机驱动
- TB6612
- 输出使能端口
- 气泵控制
sheet 4
- SPI1
- SPI1
- SPI1
- 无刷电机
- 指示灯
- NRF24L01
- 蜂鸣器

# Schematic 控制板

## Sheets
1 STM32C6T6: Create Date: 2024-04-04; Page Name: STM32C6T6; Project Name: 遥控小车+机械臂; Schematic Name: 数据发送; Update Date: 2024-04-04; Company: 嘉立创EDA; Drawed: Ideal_Fox; Page Size: A4; Version: V1.0
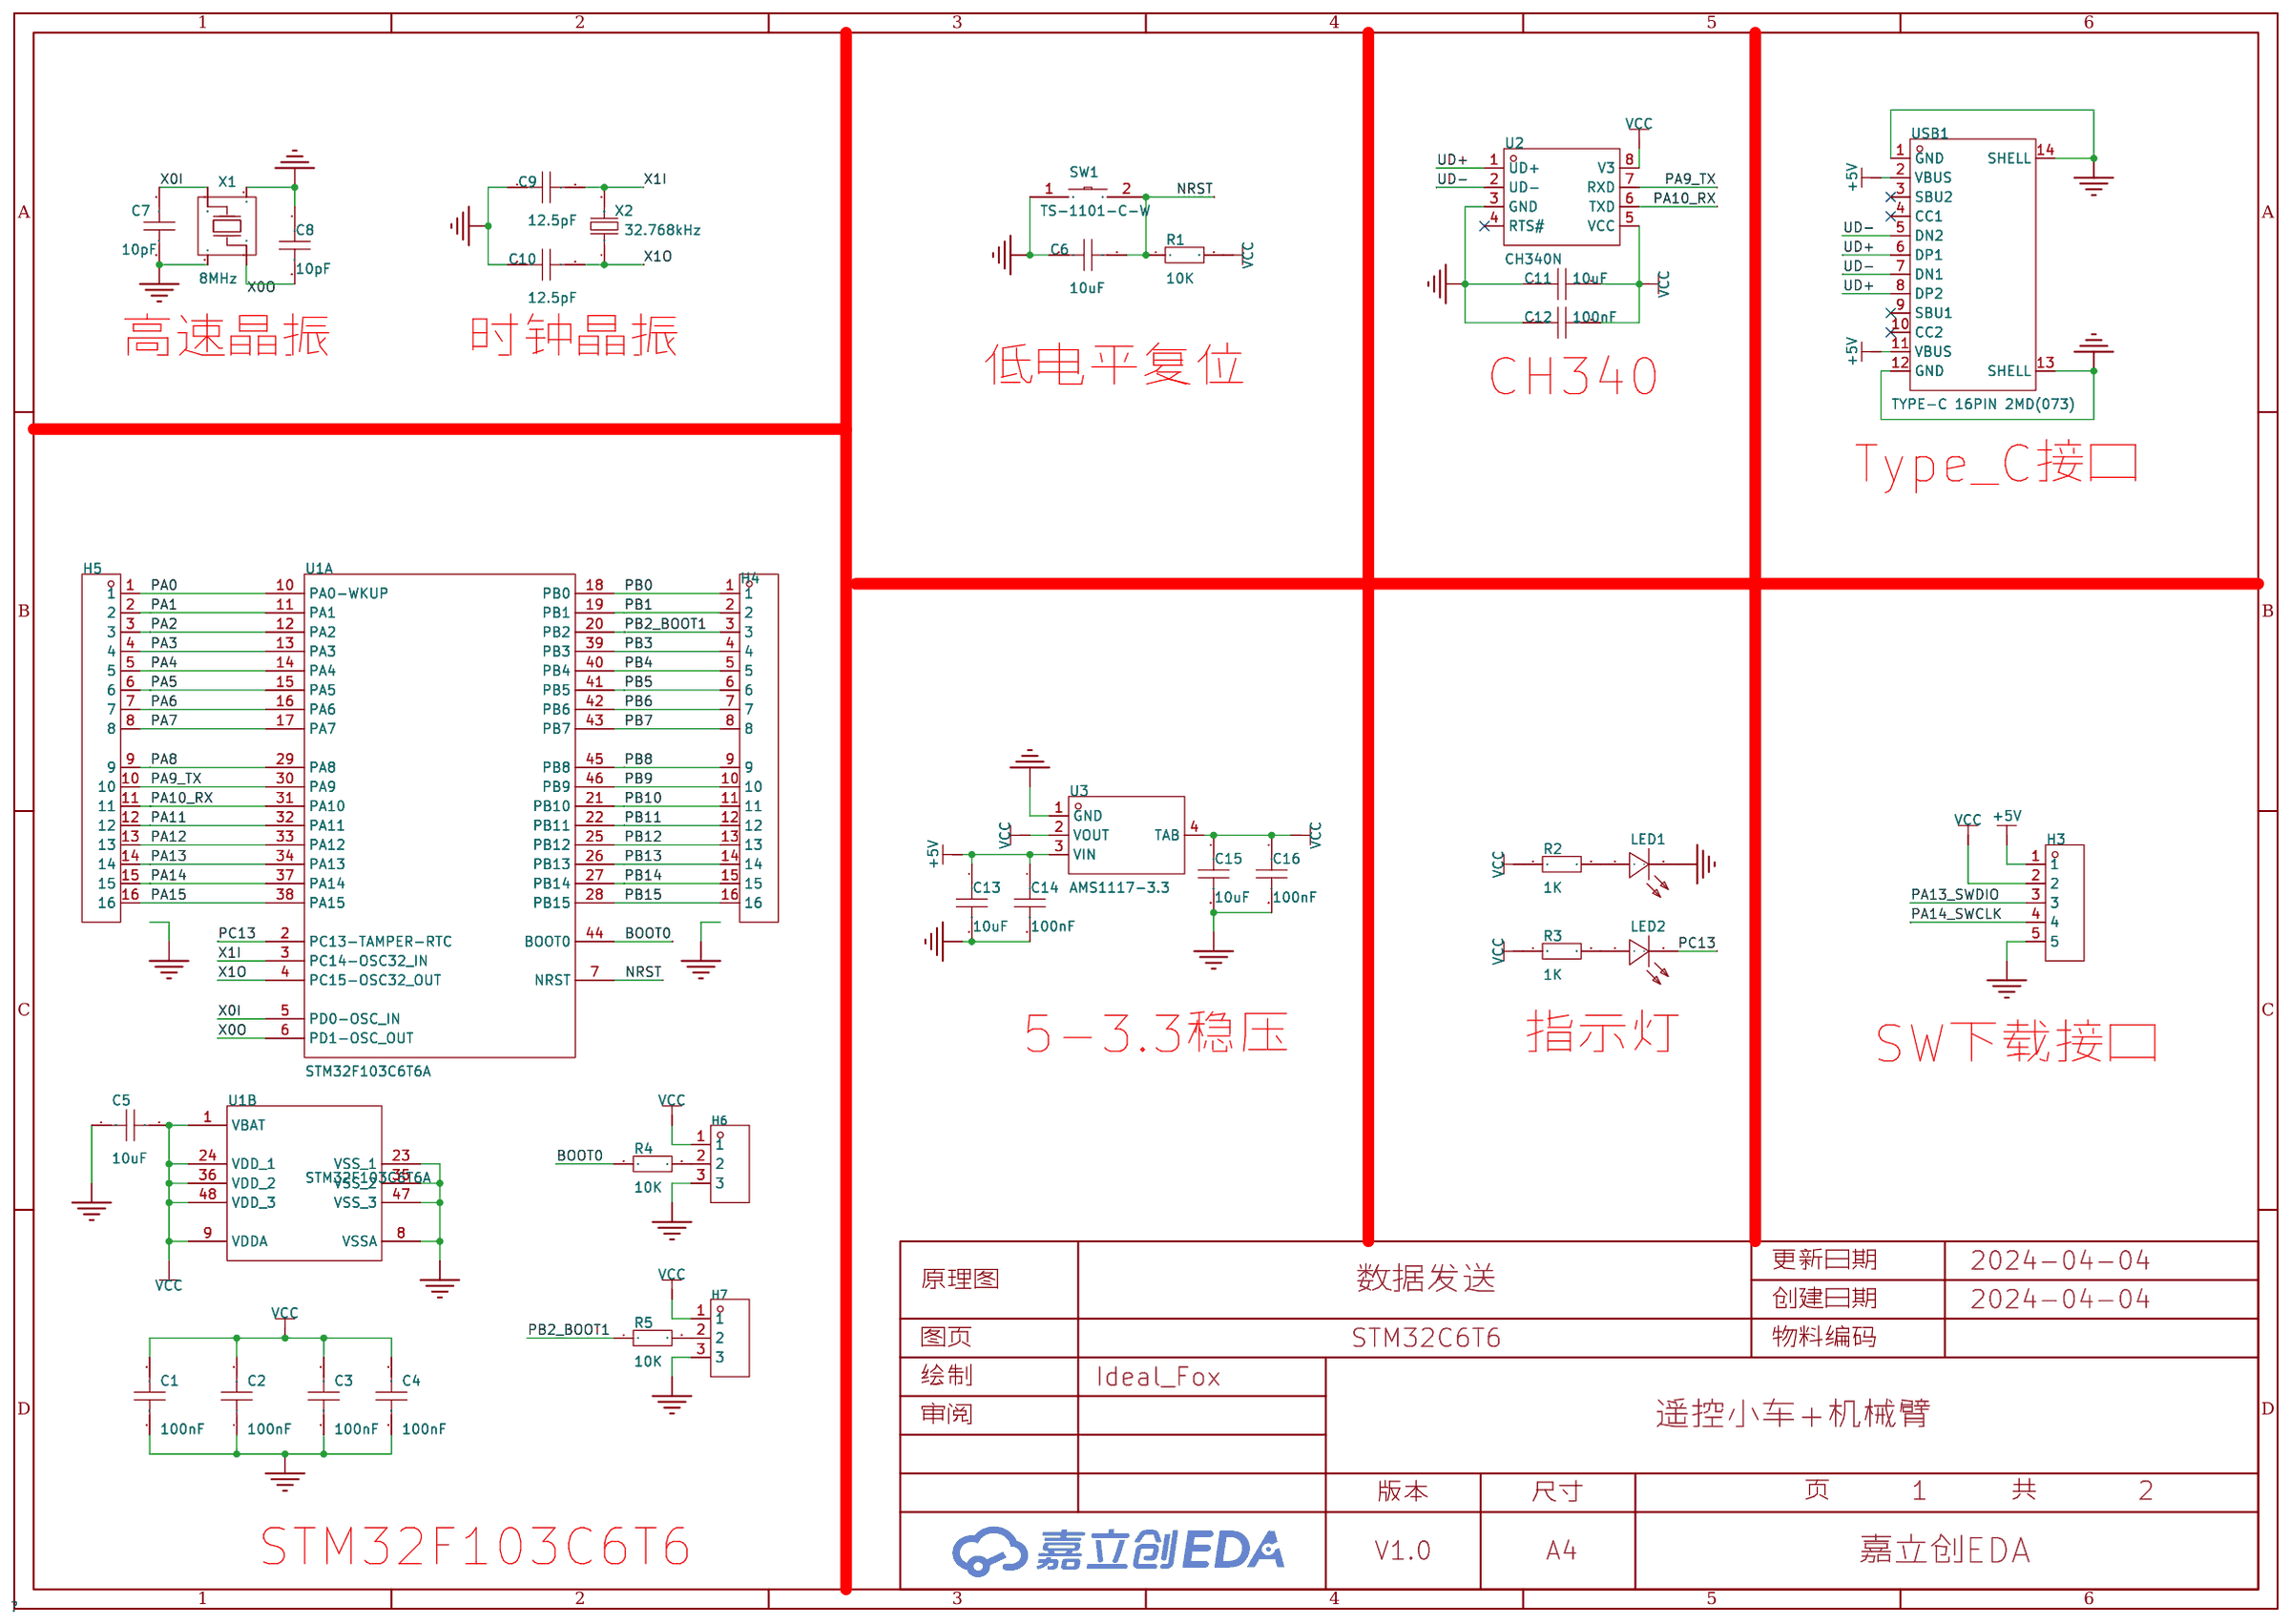
[diagram p4: STM32C6T6]
2 控制板电路: Page Name: 控制板电路; Project Name: Explorer; Schematic Name: 控制板; Update Date: 2024-10-26
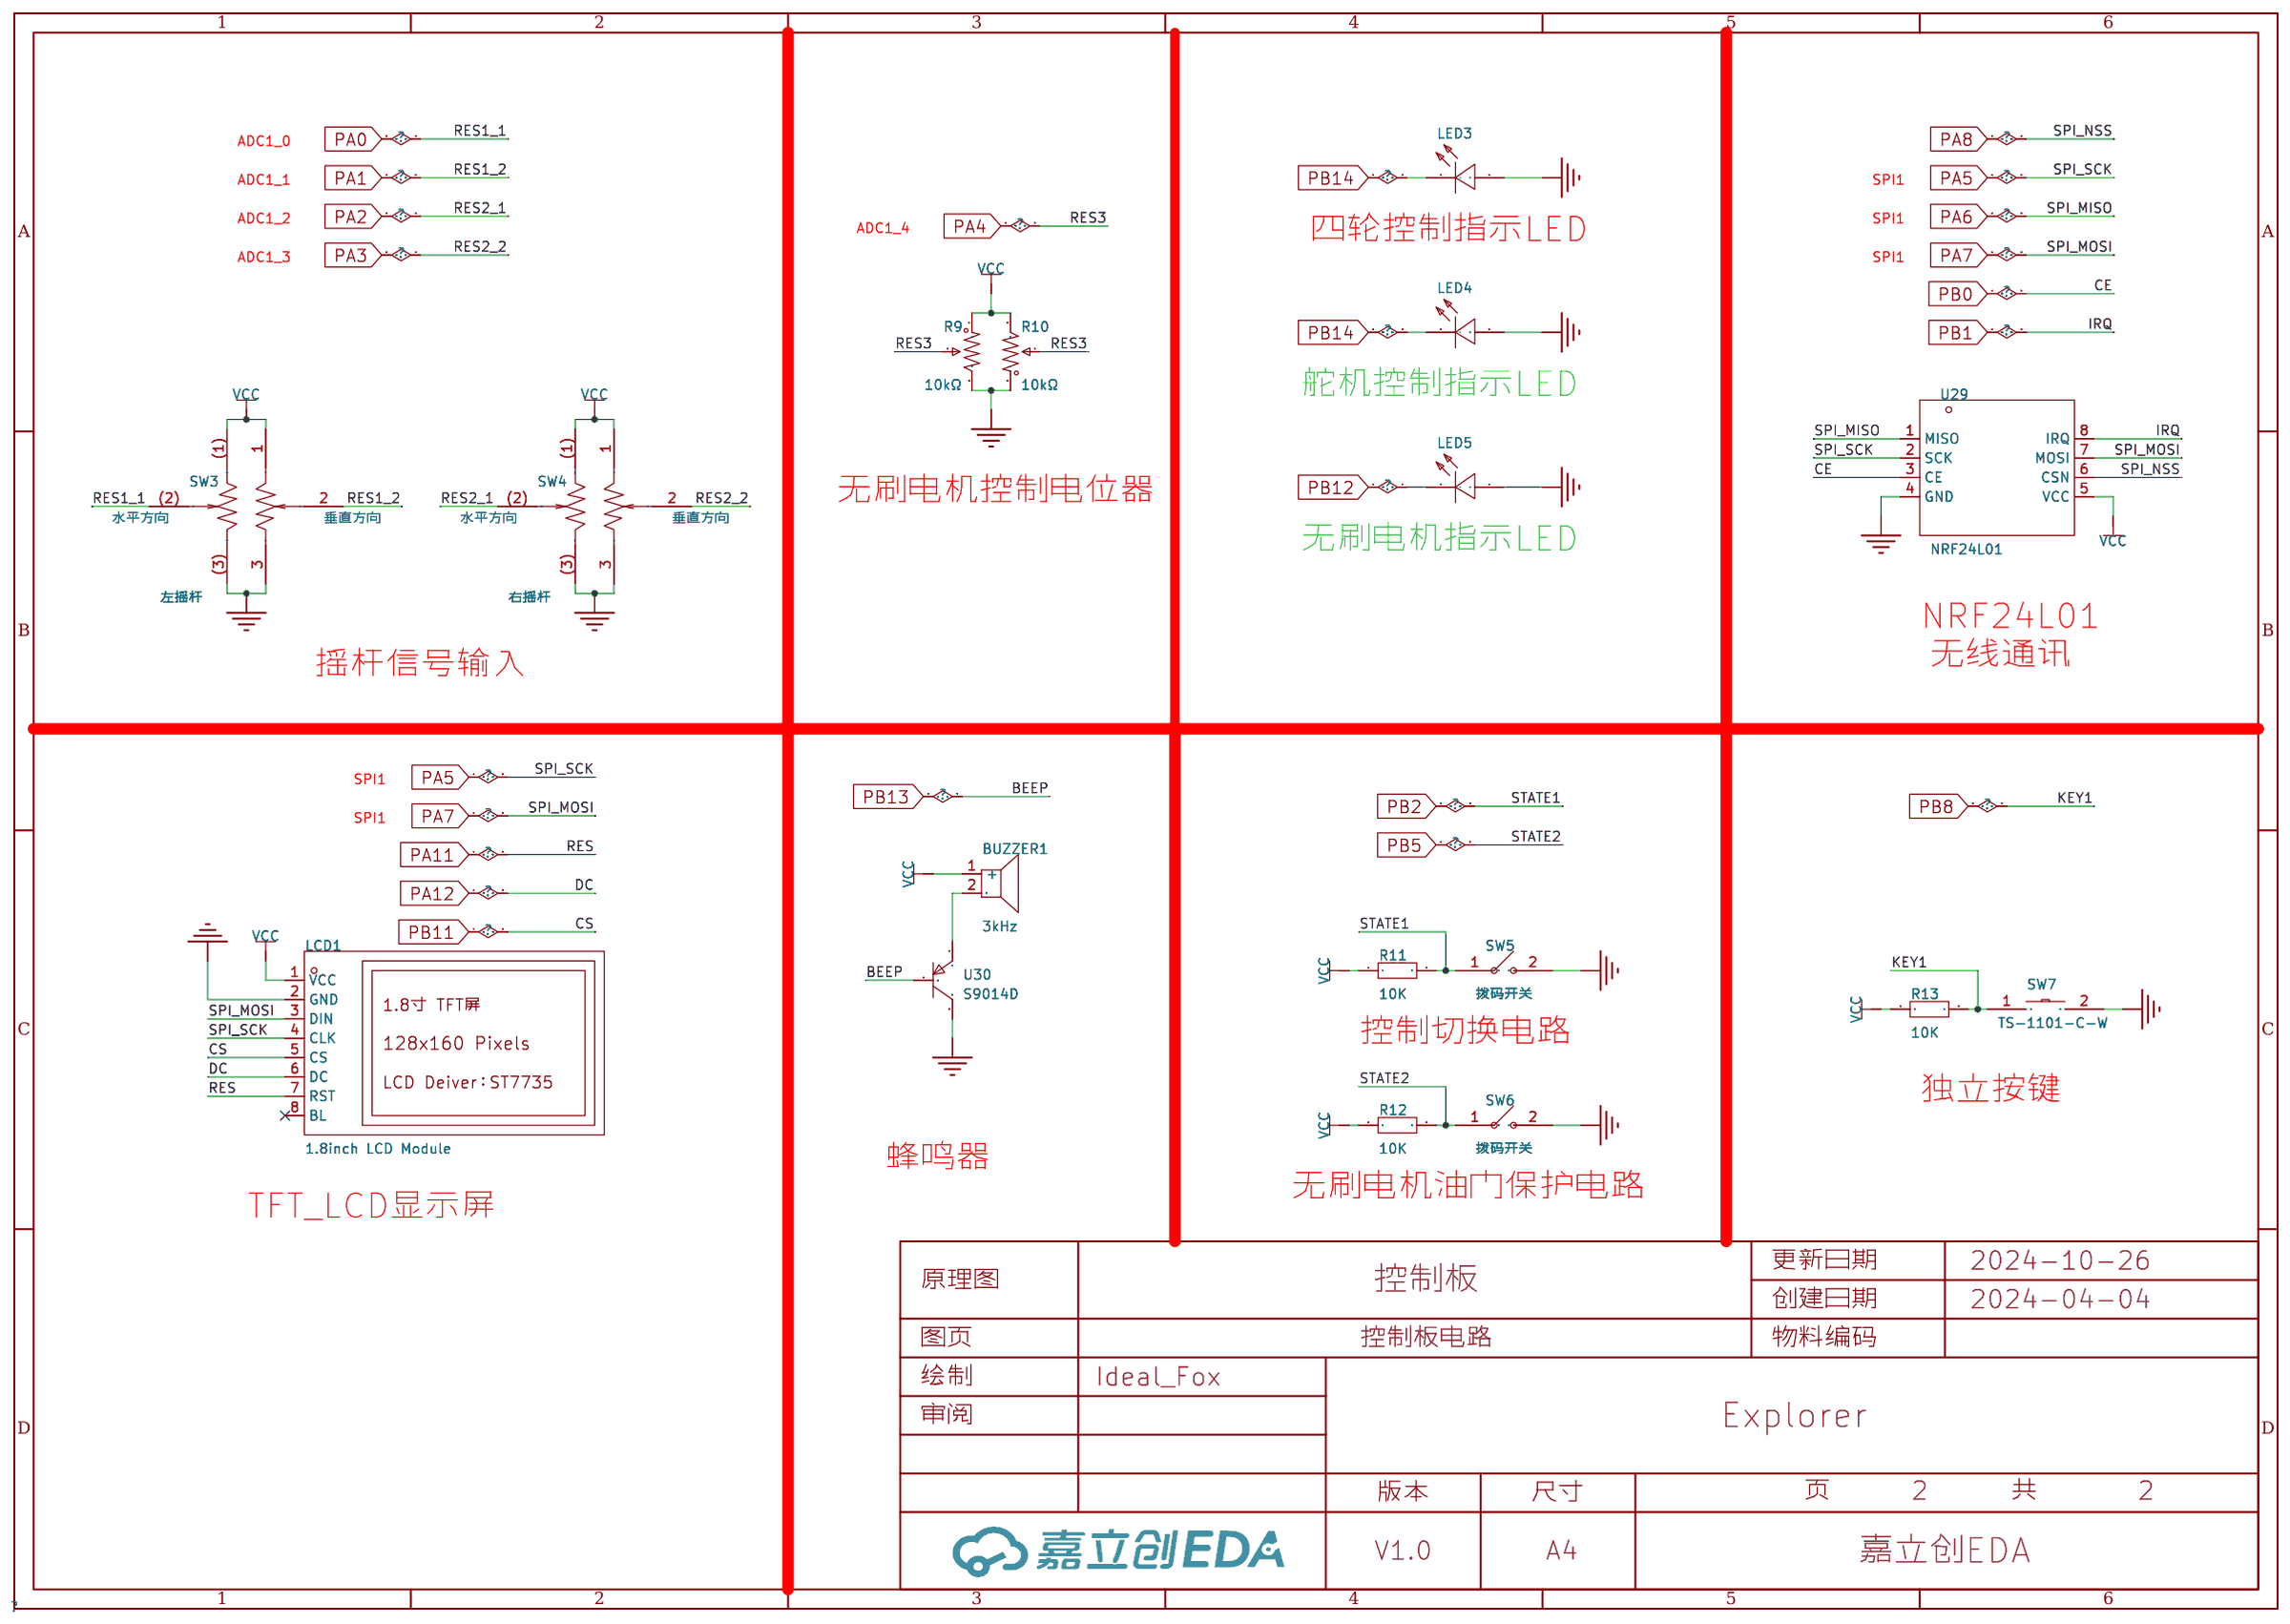
[diagram p5: 控制板电路]

## Parts
sheet STM32C6T6
C1  100nF  [C0603]
C2  100nF  [C0603]
C3  100nF  [C0603]
C4  100nF  [C0603]
C5  10uF  [C0603]
C6  10uF  [C0603]
C7  10pF  [C0603]
C8  10pF  [C0603]
C9  12.5pF  [C0603]
C10  12.5pF  [C0603]
C11  10uF  [C0603]
C12  100nF  [C0603]
C13  10uF  [C0603]
C14  100nF  [C0603]
C15  10uF  [C0603]
C16  100nF  [C0603]
H3  PZ254-1-05-W-8.5  [HDR-TH_5P-P2.54-H-M-W10.4-N]
H4  X6511WV-20H-C60D30  [HDR-TH_20P-P2.54-V-M]
H5  X6511WV-20H-C60D30  [HDR-TH_20P-P2.54-V-M]
H6  PZ254V-11-03P  [HDR-TH_3P-P2.54-V-M]
H7  PZ254V-11-03P  [HDR-TH_3P-P2.54-V-M]
LED1  NCD0805R1  [LED0805-R-RD]
LED2  NCD0805R1  [LED0805-R-RD]
R1  10K  [R0603]
R2  1K  [R0603]
R3  1K  [R0603]
R4  10K  [R0603]
R5  10K  [R0603]
SW1  TS-1101-C-W  [SW-SMD_L6.0-W3.3-LS8.0]
U1  STM32F103C6T6A  [LQFP-48_L7.0-W7.0-P0.50-LS9.0-BL]  (sections 1,2)
U2  CH340N  [SOP-8_L4.9-W3.9-P1.27-LS6.0-BL]
U3  AMS1117-3.3  [SOT-223-3_L6.5-W3.5-P3.05-LS7.0]
USB1  TYPE-C 16PIN 2MD(073)  [USB-C-SMD_TYPE-C-6PIN-2MD-073]
X1  8MHz  [OSC-SMD_4P-L3.2-W2.5-BL]
X2  32.768kHz  [FC-135R_L3.2-W1.5]
sheet 控制板电路
BUZZER1  3kHz  [BUZ-TH_BD9.6-P5.00-D0.7-FD]
LCD1  1.8inch LCD Module  [LCD-TH_L56.5-W34.0_1-8INCH-LCD-MODULE]
LED3  NCD0805R1  [LED0805-R-RD]
LED4  NCD0805R1  [LED0805-R-RD]
LED5  NCD0805R1  [LED0805-R-RD]
R9  10kΩ  [RES-ADJ-TH_3P-L10.0-W10.0-P2.50-L]
R10  10kΩ  [RES-ADJ-TH_3P-L10.0-W10.0-P2.50-L]
R11  10K  [R0603]
R12  10K  [R0603]
R13  10K  [R0603]
SW3  左摇杆  [SW-TH_3D161]
SW4  右摇杆  [SW-TH_3D161]
SW5  拨码开关  [SW-SMD_DSHP01TSGER]
SW6  拨码开关  [SW-SMD_DSHP01TSGER]
SW7  TS-1101-C-W  [SW-SMD_L6.0-W3.3-LS8.0]
U29  NRF24L01  [QFN-20_L4.0-W4.0-P0.50-BL-EP2.7]
U30  S9014D  [TO-92-3_L4.6-W3.6-P1.27-L]

## Library data of the parts
C1-C16 = CAP_0603: Supplier Footprint: 0603
H3 = PZ254-1-05-W-8.5: 插针结构:1x5P;间距:2.54mm;行距:-;圆针/方针:方针;安装类型:弯插;排数:单排;总PIN位数:5P;额定电流:3A;额定电压:-;配合针长度:6mm;塑高:2.5mm;端接针长度:-;触头材质:-;工作温度范围:-40℃~+105℃;焊接温度(最大值):260℃@10S;颜色:黑色;; LCSC Part Name: 1x5P 间距:2.54mm 方针 弯插; Supplier Part: C2894947; Manufacturer: HCTL(华灿天禄); Supplier Footprint: 弯插,P=2.54mm; JLCPCB Part Class: 扩展库; Datasheet: https://atta.szlcsc.com/upload/public/pdf/source/20230609/872AF364EDF8DB2CAF0930EAB94ECB6E.pdf; Supplier: LCSC; Pin Structure: 1x5P; Pitch: 2.54mm; Circluar Pins/Square Pins: 方针; Mounting Type: 弯插; Number of Rows: 单排; Number of Pins: 5P; Current Rating (Max): 3A; Length of Mating Pin: 6mm; Insulation Height: 2.5mm; Operating Temperature Range: -40℃~+105℃; Soldering Temperature(Max): 260℃@10S; Color: 黑色
H4 H5 = X6511WV-20H-C60D30: 插针结构:1x20P;间距:2.54mm;行距:2.54mm;圆针/方针:方针;安装类型:直插;排数:单排;总PIN位数:20P;额定电流:3A;额定电压:250V;配合针长度:6mm;塑高:2.5mm;端接针长度:3mm;触头材质:黄铜;触头镀层:金;工作温度范围:-40℃~+105℃;焊接温度(最大值):260℃;颜色:黑色;; LCSC Part Name: 1x20P 间距:2.54mm 方针 直插; Supplier Part: C725952; Manufacturer: XKB Connection(中国星坤); Supplier Footprint: 插件,P=2.54mm; JLCPCB Part Class: 扩展库; Datasheet: https://atta.szlcsc.com/upload/public/pdf/source/20221108/2FDDF9C694C8EDC81165E23F2EAAE597.pdf; Supplier: LCSC; Pin Structure: 1x20P; Pitch: 2.54mm; Row Spacing: 2.54mm; Circluar Pins/Square Pins: 方针; Mounting Type: 直插; Number of Rows: 单排; Number of Pins: 20P; Current Rating (Max): 3A; Voltage Rating (Max): 250V; Length of Mating Pin: 6mm; Insulation Height: 2.5mm; Length of End Connection Pin: 3mm; Contact Material: 黄铜; Contact Plating: 金; Operating Temperature Range: -40℃~+105℃; Soldering Temperature(Max): 260℃; Color: 黑色
H6 H7 = PZ254V-11-03P: 插针结构:1x3P;间距:2.54mm;行距:-;圆针/方针:方针;安装类型:直插;排数:单排;总PIN位数:3P;额定电流:3A;额定电压:250V;配合针长度:6mm;塑高:2.5mm;端接针长度:3mm;工作温度范围:-40℃~+105℃;颜色:黑色;; LCSC Part Name: 间距:2.54mm 1x3P 直插 方针; Supplier Part: C2937625; Manufacturer: XFCN(兴飞); Supplier Footprint: 插件,P=2.54mm; JLCPCB Part Class: 扩展库; Datasheet: https://atta.szlcsc.com/upload/public/pdf/source/20200309/C492402_8335C3D49C4E4C618838D59BB1D024C1.pdf; Supplier: LCSC; Pin Structure: 1x3P; Pitch: 2.54mm; Circluar Pins/Square Pins: 方针; Mounting Type: 直插; Number of Rows: 单排; Number of Pins: 3P; Current Rating (Max): 3A; Voltage Rating (Max): 250V; Length of Mating Pin: 6mm; Insulation Height: 2.5mm; Length of End Connection Pin: 3mm; Operating Temperature Range: -40℃~+105℃; Color: 黑色
LED1-LED5 = NCD0805R1: 灯头类型:-;发光颜色:红色;正向电压(VF):1.6V~2.6V;功率:65mW;正向电流:20mA;主波长:615nm~630nm;二极管配置:独立二极管;透镜颜色:无色透明透镜;色温:-;发光强度:67mcd~195mcd;发光角度:130°;载带方式:-;工作温度:-30℃~+85℃;; Supplier Part: C84256; Manufacturer: 国星光电; Supplier Footprint: 0805; JLCPCB Part Class: 基础库; Datasheet: https://atta.szlcsc.com/upload/public/pdf/source/20200820/C84256_F0A75A43B3EAD75808600A0514C76B99.pdf; Supplier: LCSC; Emitted Color: 红色; Forward Voltage (VF): 1.6V~2.6V; Power Dissipation: 65mW; Forward Current: 20mA; Dominant Wavelength: 615nm~630nm; Diode Configuration: 独立二极管; Lens Color: 无色透明透镜; Luminous Intensity: 67mcd~195mcd; Viewing Angle: 130°; Operating Temperature: -30℃~+85℃
R1-R5 R11-R13 = Res_0603: Supplier Footprint: 0603
SW1 SW7 = TS-1101-C-W: 电路结构:单刀单掷;按钮形状:矩形按钮;作用力:260gf;安装方式:立贴;开关长度:6mm;开关宽度:3.6mm;开关高度:2.5mm;带支架:不带;触点电流:50mA;额定电压(AC):-;额定电压(DC):12V;额定功率:-;绝缘电阻:-;带灯:无;机械寿命:5万次;; LCSC Part Name: 6*3.6*2.5mm 立贴 轻触开关; Supplier Part: C318938; Manufacturer: XKB Connectivity(中国星坤); Supplier Footprint: SMD; JLCPCB Part Class: 扩展库; Datasheet: https://atta.szlcsc.com/upload/public/pdf/source/20200227/C318938_C2E53B1EEDE37D980A33616AC086DE53.pdf; Supplier: LCSC; Circuit: 单刀单掷; Actuator Style: 矩形按钮; Operating Force: 260gf; Mounting Style: 立贴; Switch Length: 6mm; Switch Width: 3.6mm; Switch Height: 2.5mm; Strike Gundam: 不带; Contact Current: 50mA; Voltage Rating (DC): 12V; Actuator/Cap Color: 白色带淡绿; With Lamp: 无; Mechanical Life: 5万次; Operating Temperature: -30℃~+85℃
U1 = STM32F103C6T6A: CPU内核:CM3;程序存储容量:32KB;RAM总容量:10KB;GPIO端口数量:37;工作电压范围:2V~3.6V;CPU最大主频:72MHz;程序存储器类型:FLASH;; Supplier Part: C8303; Manufacturer: ST(意法半导体); Supplier Footprint: LQFP-48(7x7); JLCPCB Part Class: 扩展库; Datasheet: https://atta.szlcsc.com/upload/public/pdf/source/20140724/1457707171306.pdf; Supplier: LCSC; CPU Core: CM3; Program Storage Size: 32KB; RAM Size: 10KB; GPIO Ports Number: 37; Operating Voltage Range: 2V~3.6V; CPU Maximum Speed: 72MHz; Program Memory Type: FLASH; Operating Temperature Range: -40℃~+85℃; ADC (Bit): 12bit; Universal Serial Bus: 有; Peripheral/Function: DMA；片载温度传感器；PWM; Watchdog: 有; Infrared Data Association: 有; Low-Voltage Detect: 有; Direct Memory Access: 有; Internal Oscillator: 有
U2 = CH340N: LCSC Part Name: USB转串口芯片 CH340; Supplier Part: C2977777; Manufacturer: WCH(南京沁恒); Supplier Footprint: SOP-8; JLCPCB Part Class: 扩展库; Datasheet: https://atta.szlcsc.com/upload/public/pdf/source/20230530/6E401E9554E9F5311886CC8B3F89B62E.pdf; Supplier: LCSC
U3 = AMS1117-3.3_C5250992: 输出类型：固定 输出极性：正 最大输入电压：18V 输出电压：3.3V 输出电流：1A 电源纹波抑制比(PSRR)：60dB@(120Hz)。当前应用较多领域：三端稳压器，机顶盒; Supplier Part: C5250992; Manufacturer: TWGMC(台湾迪嘉); Supplier Footprint: SOT-223-3L; JLCPCB Part Class: 扩展库; Datasheet: https://atta.szlcsc.com/upload/public/pdf/source/20221109/A58A92B07670E85D28928AE371260E8D.pdf; Supplier: LCSC
USB1 = TYPE-C 16PIN 2MD(073): 连接器类型:Type-C;标准:-;公母:母;端口数量:1;触点数量:16P;安装方式:卧贴;额定电流 - 电源:5A;工作温度范围:-25℃~+85℃;; LCSC Part Name: Type-C 母 卧贴; Supplier Part: C2765186; Manufacturer: SHOU HAN(首韩); Supplier Footprint: SMD; JLCPCB Part Class: 扩展库; Datasheet: https://atta.szlcsc.com/upload/public/pdf/source/20211123/39B17C16241EAC15C5E277BDA434118E.pdf; Supplier: LCSC; Connector Type: Type-C; Gender: 母; Number of Ports: 1; Number of Contacts: 16P; Mounting Style: 卧贴; Current Rating - Power (Max): 5A; Operating Temperature Range: -25℃~+85℃
X1 = TAXM8M4RDBCCT2T: 晶振类型:贴片晶振;频率:8MHz;常温频差:±10ppm;外接负载电容:10pF;频率稳定度(全温):±15ppm;; LCSC Part Name: 8MHz ±10ppm 10pF; Supplier Part: C400090; Manufacturer: YJX(雅晶鑫); Supplier Footprint: SMD3225-4P; JLCPCB Part Class: 扩展库; Datasheet: https://atta.szlcsc.com/upload/public/pdf/source/20190626/C400090_CF95B89E745AFE4EF2E392EF8AC009D6.pdf; Supplier: LCSC; Crystal Type: 贴片晶振; Normal temperature Frequency Tolerance: ±10ppm; External load capacitor: 10pF; Frequency Stability(Full temperature range): ±15ppm; Equivalent Series Resistance (ESR): 250Ω; Operating Temperature: -40℃~+85℃
X2 = Q13FC13500004_C32346: 晶振类型:贴片晶振;频率:32.768kHz;常温频差:±20ppm;外接负载电容:12.5pF;; LCSC Part Name: 32.768kHz ±20ppm 12.5pF; Supplier Part: C32346; Manufacturer: EPSON(爱普生); Manufacturer Part: Q13FC13500004; Supplier Footprint: SMD3215-2P; JLCPCB Part Class: 基础库; Datasheet: https://atta.szlcsc.com/upload/public/pdf/source/20190108/C32346_746D6B07EAF90824457A96480007685F.pdf; Supplier: LCSC; Crystal Type: 贴片晶振; Normal temperature Frequency Tolerance: ±20ppm; External load capacitor: 12.5pF; Equivalent Series Resistance (ESR): 70kΩ; Operating Temperature: -40℃~+85℃
BUZZER1 = HNB09A05: 驱动方式:有源(内含驱动线路);构造类型:电磁式;频率:3kHz;声压(SPL):85dB;; Supplier Part: C96493; Manufacturer: 华能; Supplier Footprint: 插件,D=9mm; JLCPCB Part Class: 扩展库; Datasheet: https://atta.szlcsc.com/upload/public/pdf/source/20170522/1495448327549.pdf; Supplier: LCSC; Oscillator Circuit: 有源(内含驱动线路); Technology Type: 电磁式; Operating Voltage: 4V~8V; Sound Pressure Level (SPL): 85dB; Diameter (φD): 9mm; Height: 5.7mm
LCD1 = 1.8inch LCD Module: 主控芯片:ST7735S;尺寸(inch):1.8;; LCSC Part Name: 树莓派 1.8寸LCD 迷你显示屏 扩展板 SPI接口 支持Arduino; Supplier Part: C359940; Manufacturer: Waveshare(微雪电子); JLCPCB Part Class: 扩展库; Datasheet: https://atta.szlcsc.com/upload/public/pdf/source/20190107/C359940_B08D95A5D16FFF3D67403C4EC320696B.pdf; Supplier: LCSC; Main Control Chip: ST7735S; Size: 1.8
R9 R10 = 3296W-1-103: 阻值:10kΩ;精度:±10%;; LCSC Part Name: 10kΩ ±10%; Supplier Part: C118954; Manufacturer: BOCHEN(博晨); Supplier Footprint: 插件; JLCPCB Part Class: 扩展库; Datasheet: https://atta.szlcsc.com/upload/public/pdf/source/20171114/C118954_15106326646611117443.pdf; Supplier: LCSC; Tolerance: ±10%
SW3 SW4 = 3D161: 摇杆  多向; LCSC Part Name: 3D161  3D摇杆 自恢复; Supplier Part: C92593; Manufacturer: 韩国韩荣; Supplier Footprint: 插件,16x16mm; JLCPCB Part Class: 扩展库; Datasheet: https://atta.szlcsc.com/upload/public/pdf/source/20170523/1495534045704.pdf; Supplier: LCSC
SW5 SW6 = DSHP01TSGER: 电路结构:单刀单掷;开关位数:1位;额定电流:25mA;额定电压:24V;使用寿命:3千次;颜色:黑色;; LCSC Part Name: 1位单PIN 1.27mm间距贴片型 KE拨码开关 编码开关; Supplier Part: C3293141; Manufacturer: 康深; Supplier Footprint: SMD,2.9x5.4mm; JLCPCB Part Class: 扩展库; Datasheet: https://atta.szlcsc.com/upload/public/pdf/source/20220713/BDDC0447A52B6A23E8804DA200FD4C7C.pdf; Supplier: LCSC; Circuit: 单刀单掷; Number of Positions: 1位; Current Rating: 25mA; Voltage Rating: 24V; Operating Temperature: -30℃~+85℃; Operating Life: 3千次; Color: 黑色
U29 = NRF24L01: 频率范围:2.4GHz;接口:SPI;应用领域:通用 ISM&gt;1GHz;数据速率:2Mbps;灵敏度:-85dBm;; Supplier Part: C1558392; Manufacturer: NORDIC; Supplier Footprint: QFN-20-EP(4x4); JLCPCB Part Class: 扩展库; Supplier: LCSC; Frequency Range: 2.4GHz; Interface: SPI; Operating Voltage: 1.9V~3.6V; Applications: 通用 ISM&gt;1GHz; Output Power: 0dBm; Data Rate: 2Mbps; Current Of Transmitting: 7mA; Sensitivity: -85dBm; Receive Current: 11.1mA; Operating Temperature: -40℃~+85℃
U30 = SS9014DBU: 晶体管类型:NPN;集电极电流(Ic):100mA;集射极击穿电压(Vceo):45V;功率(Pd):450mW;直流电流增益(hFE@Ic,Vce):60@1mA,5V;; LCSC Part Name: NPN 电流:100mA 耐压:45V; Supplier Part: C3201964; Manufacturer: onsemi(安森美); Supplier Footprint: TO-92-3; JLCPCB Part Class: 扩展库; Datasheet: https://atta.szlcsc.com/upload/public/pdf/source/20230915/876D150E45002D61DA6E9B0FBE5B5A11.pdf; Supplier: LCSC; Transistor Type: NPN; Collector Current (Ic): 100mA; Collector-Emitter Breakdown Voltage (Vceo): 45V; Power Dissipation (Pd): 450mW; DC Current Gain (hFE@Ic,Vce): 60@1mA,5V; Transition Frequency (fT): 270MHz; Collector Cut-Off Current (Icbo): 50nA; Collector-Emitter Saturation Voltage (VCE(sat)@Ic,Ib): 300mV@100mA,5mA

## Nets
+5V: C13.1 C14.1 H3.1 U3.3(VIN) USB1.2(VBUS) USB1.11(VBUS)
GND: C1.1 C2.1 C3.1 C4.1 C5.2 C6.2 C7.2 C8.1 C9.1 C10.1 C11.1 C12.1 C13.2 C14.2 C15.2 C16.2 H3.5 H6.3 H7.3 LCD1.2(GND) LED1.2(-) LED3.1(+) LED4.1(+) LED5.1(+) R9.3 R10.1 SW1.1 SW3.3 SW3.(3) SW4.3 SW4.(3) SW5.2 SW6.2 SW7.2 U1.8(VSSA) U1.23(VSS_1) U1.35(VSS_2) U1.47(VSS_3) U2.3(GND) U3.1(GND) U29.4(GND) U30.3(C) USB1.1(GND) USB1.12(GND) USB1.13(SHELL) USB1.14(SHELL) X1.2 X1.4
VCC: BUZZER1.1(+) C1.2 C2.2 C3.2 C4.2 C5.1 C11.2 C12.2 C15.1 C16.1 H3.2 H6.1 H7.1 LCD1.1(VCC) R1.2 R2.1 R3.1 R9.1 R10.3 R11.1 R12.1 R13.1 SW3.1 SW3.(1) SW4.1 SW4.(1) U1.1(VBAT) U1.9(VDDA) U1.24(VDD_1) U1.36(VDD_2) U1.48(VDD_3) U2.5(VCC) U2.8(V3) U3.2(VOUT) U3.4(TAB) U29.5(VCC)
BEEP: H4.14 U1.26(PB13) U30.2(B)
BOOT0: R4.1 U1.44(BOOT0)
CE: H4.1 U1.18(PB0) U29.3(CE)
CS: H4.12 LCD1.5(CS) U1.22(PB11)
DC: H5.13 LCD1.6(DC) U1.33(PA12)
IRQ: H4.2 U1.19(PB1) U29.8(IRQ)
KEY1: H4.9 R13.2 SW7.1 U1.45(PB8)
NRST: C6.1 R1.1 SW1.2 U1.7(NRST)
PA0: H5.1 SW3.(2) U1.10(PA0-WKUP)
PA1: H5.2 SW3.2 U1.11(PA1)
PA2: H5.3 SW4.(2) U1.12(PA2)
PA3: H5.4 SW4.2 U1.13(PA3)
PA4: H5.5 R9.2 R10.2 U1.14(PA4)
PA5: H5.6 LCD1.4(CLK) U1.15(PA5) U29.2(SCK)
PA6: H5.7 U1.16(PA6) U29.1(MISO)
PA7: H5.8 LCD1.3(DIN) U1.17(PA7) U29.7(MOSI)
PA8: H5.9 U1.29(PA8) U29.6(CSN)
PA9_TX: H5.10 U1.30(PA9) U2.7(RXD)
PA10_RX: H5.11 U1.31(PA10) U2.6(TXD)
PA11: H5.12 LCD1.7(RST) U1.32(PA11)
PA13: H5.14 U1.34(PA13)
PA13_SWDIO: H3.3
PA14: H5.15 U1.37(PA14)
PA14_SWCLK: H3.4
PA15: H5.16 U1.38(PA15)
PB2: R11.2 SW5.1
PB2_BOOT1: H4.3 R5.1 U1.20(PB2)
PB3: H4.4 U1.39(PB3)
PB4: H4.5 U1.40(PB4)
PB5: H4.6 R12.2 SW6.1 U1.41(PB5)
PB6: H4.7 U1.42(PB6)
PB7: H4.8 U1.43(PB7)
PB9: H4.10 U1.46(PB9)
PB10: H4.11 U1.21(PB10)
PB12: H4.13 LED5.2(-) U1.25(PB12)
PB14: H4.15 LED3.2(-) LED4.2(-) U1.27(PB14)
PB15: H4.16 U1.28(PB15)
PC13: LED2.2(-) U1.2(PC13-TAMPER-RTC)
UD+: U2.1(UD+) USB1.6(DP1) USB1.8(DP2)
UD-: U2.2(UD-) USB1.5(DN2) USB1.7(DN1)
X0I: C7.1 U1.5(PD0-OSC_IN) X1.3
X0O: C8.2 U1.6(PD1-OSC_OUT) X1.1
X1I: C9.2 U1.3(PC14-OSC32_IN) X2.2
X1O: C10.2 U1.4(PC15-OSC32_OUT) X2.1
Net-(BUZZER1-2): BUZZER1.2 U30.1(E)
Net-(H6-2): H6.2 R4.2
Net-(H7-2): H7.2 R5.2
Net-(LED1-1): LED1.1(+) R2.2
Net-(LED2-1): LED2.1(+) R3.2

Not connected (* = marked no-connect by the designer): LCD1 8(BL)*; U2 4(RTS#)*; USB1 3(SBU2)* 4(CC1)* 9(SBU1)* 10(CC2)*

## Notes on the sheets
sheet 1
- 高速晶振
- 时钟晶振
- 低电平复位
- CH340
- Type_C接口
- 5-3.3稳压
- 指示灯
- SW下载接口
- STM32F103C6T6
sheet 2
- ADC1_0
- ADC1_1
- SPI1
- ADC1_2
- SPI1
- ADC1_4
- 四轮控制指示LED
- ADC1_3
- SPI1
- 舵机控制指示LED
- 水平方向
- 垂直方向
- 水平方向
- 垂直方向
- 无刷电机控制电位器
- 无刷电机指示LED
- NRF24L01
- 摇杆信号输入
- 无线通讯
- SPI1
- SPI1
- 控制切换电路
- 独立按键
- 蜂鸣器
- 无刷电机油门保护电路
- TFT_LCD显示屏
